# EAGLE board alltogether_8.2_4w (EAGLE 9.1.0), part 1 of 6
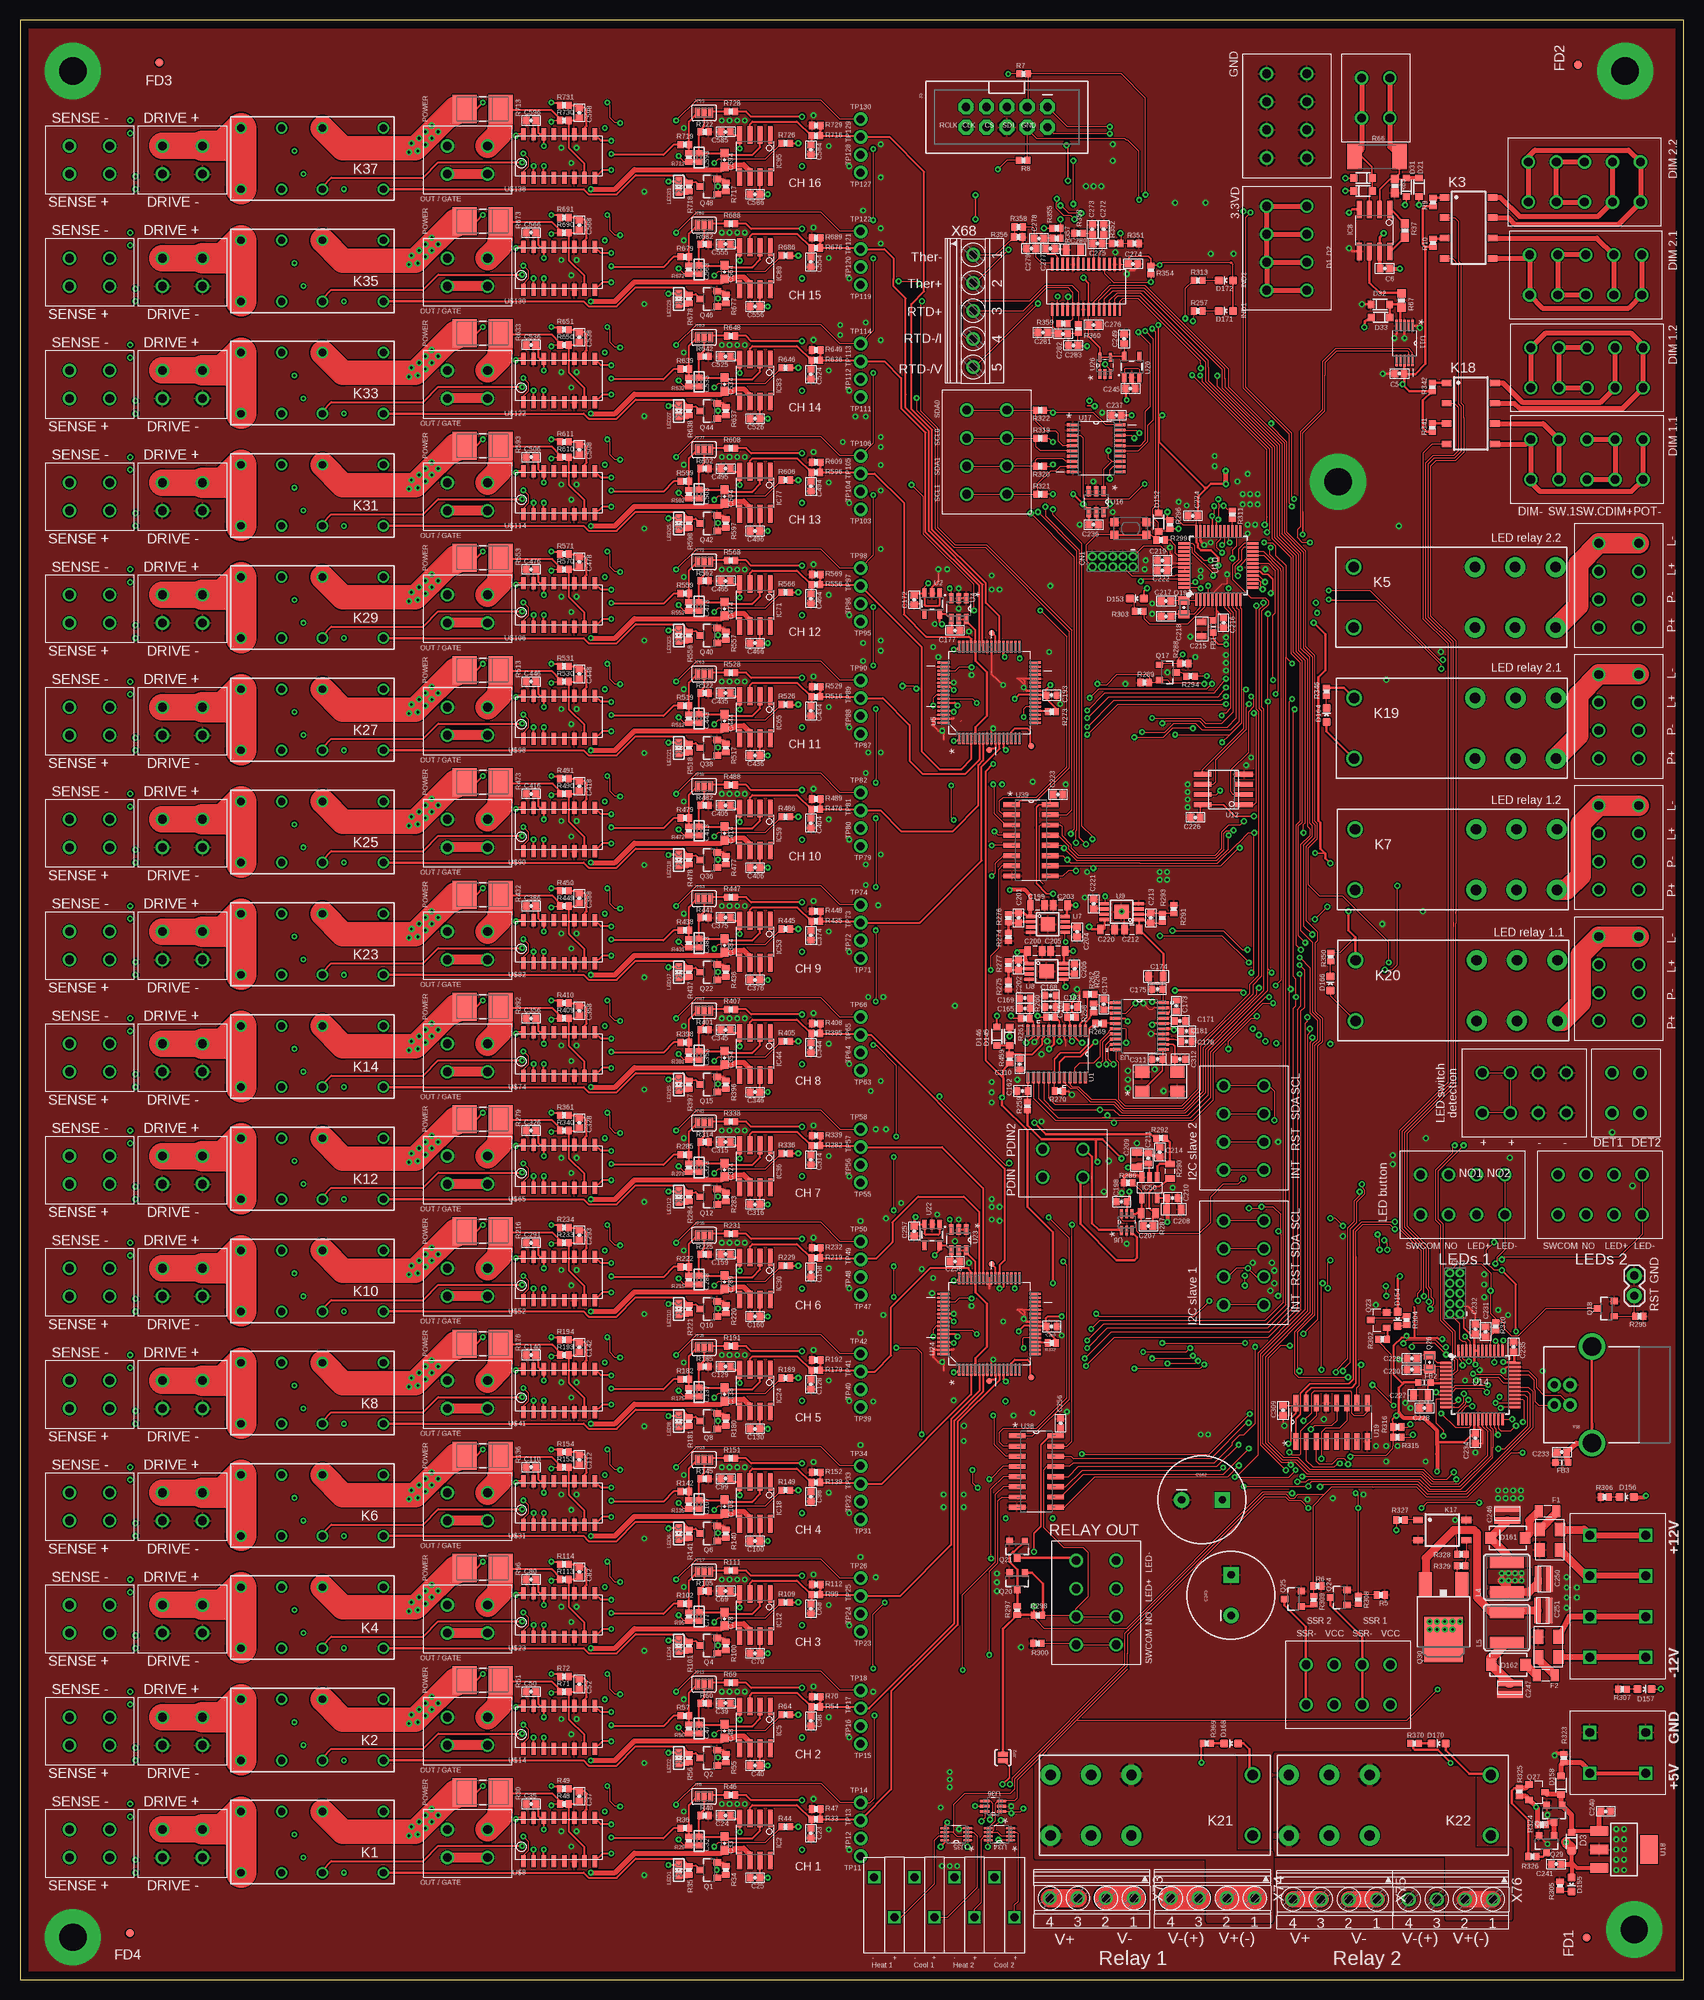
[diagram p31: board, top side]
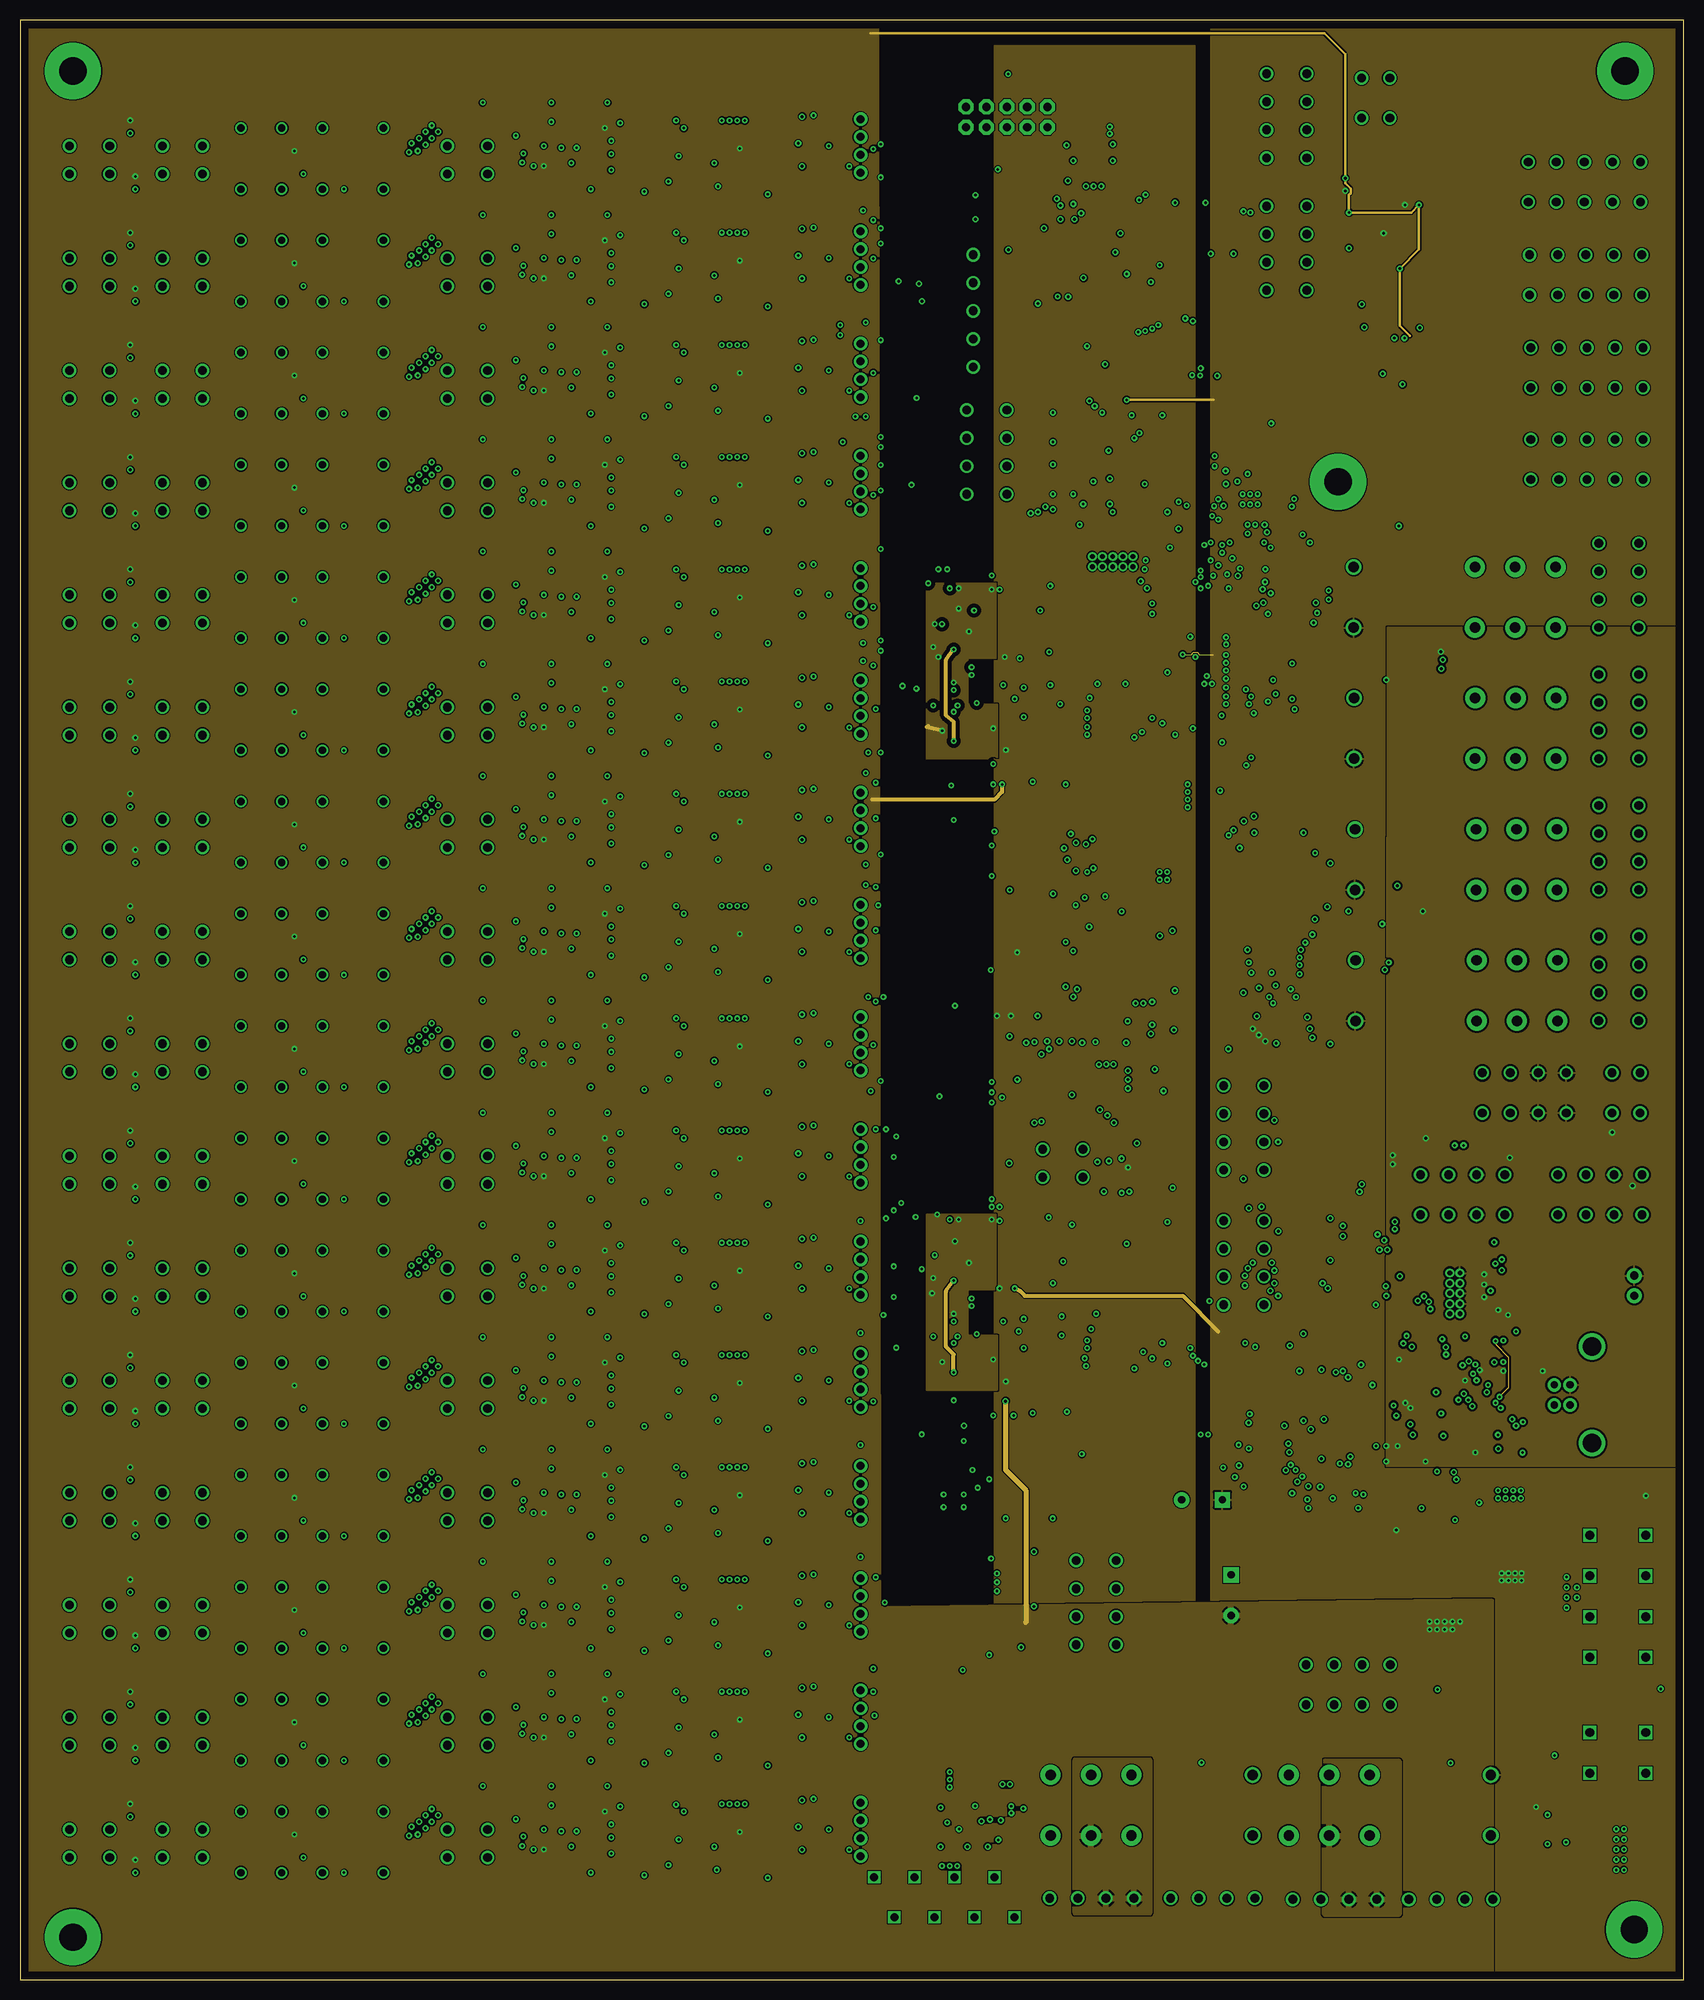
[diagram p32: board, inner layer Route2]
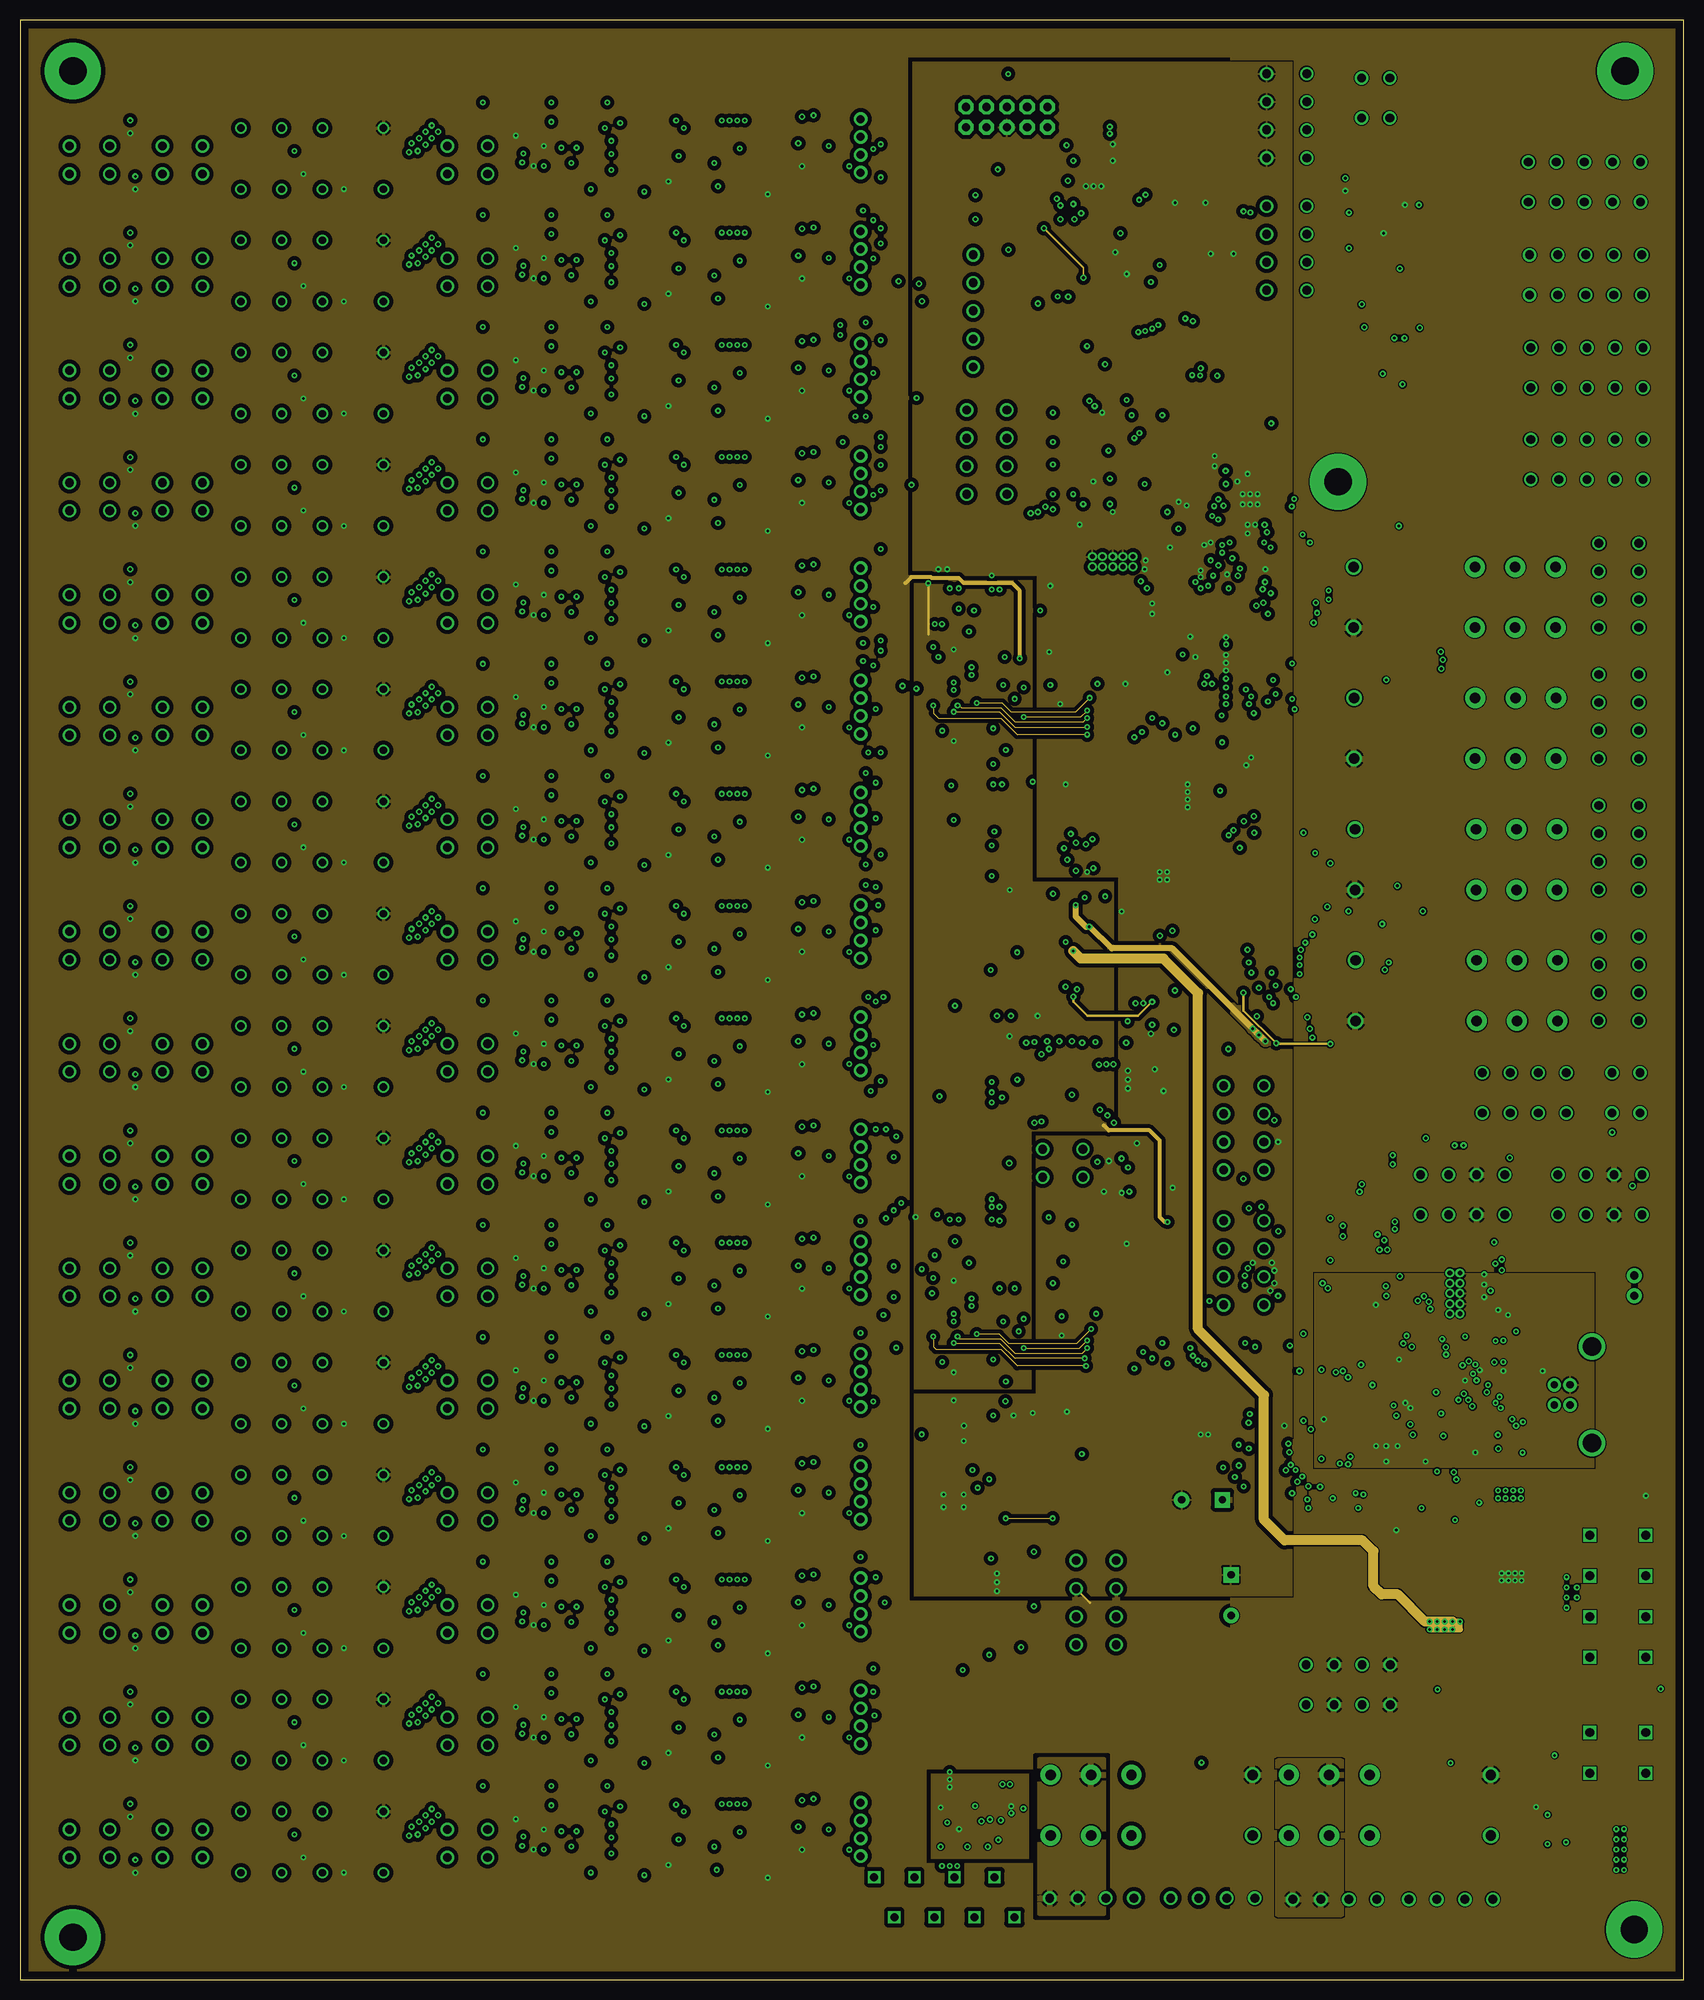
[diagram p33: board, inner layer Route15]
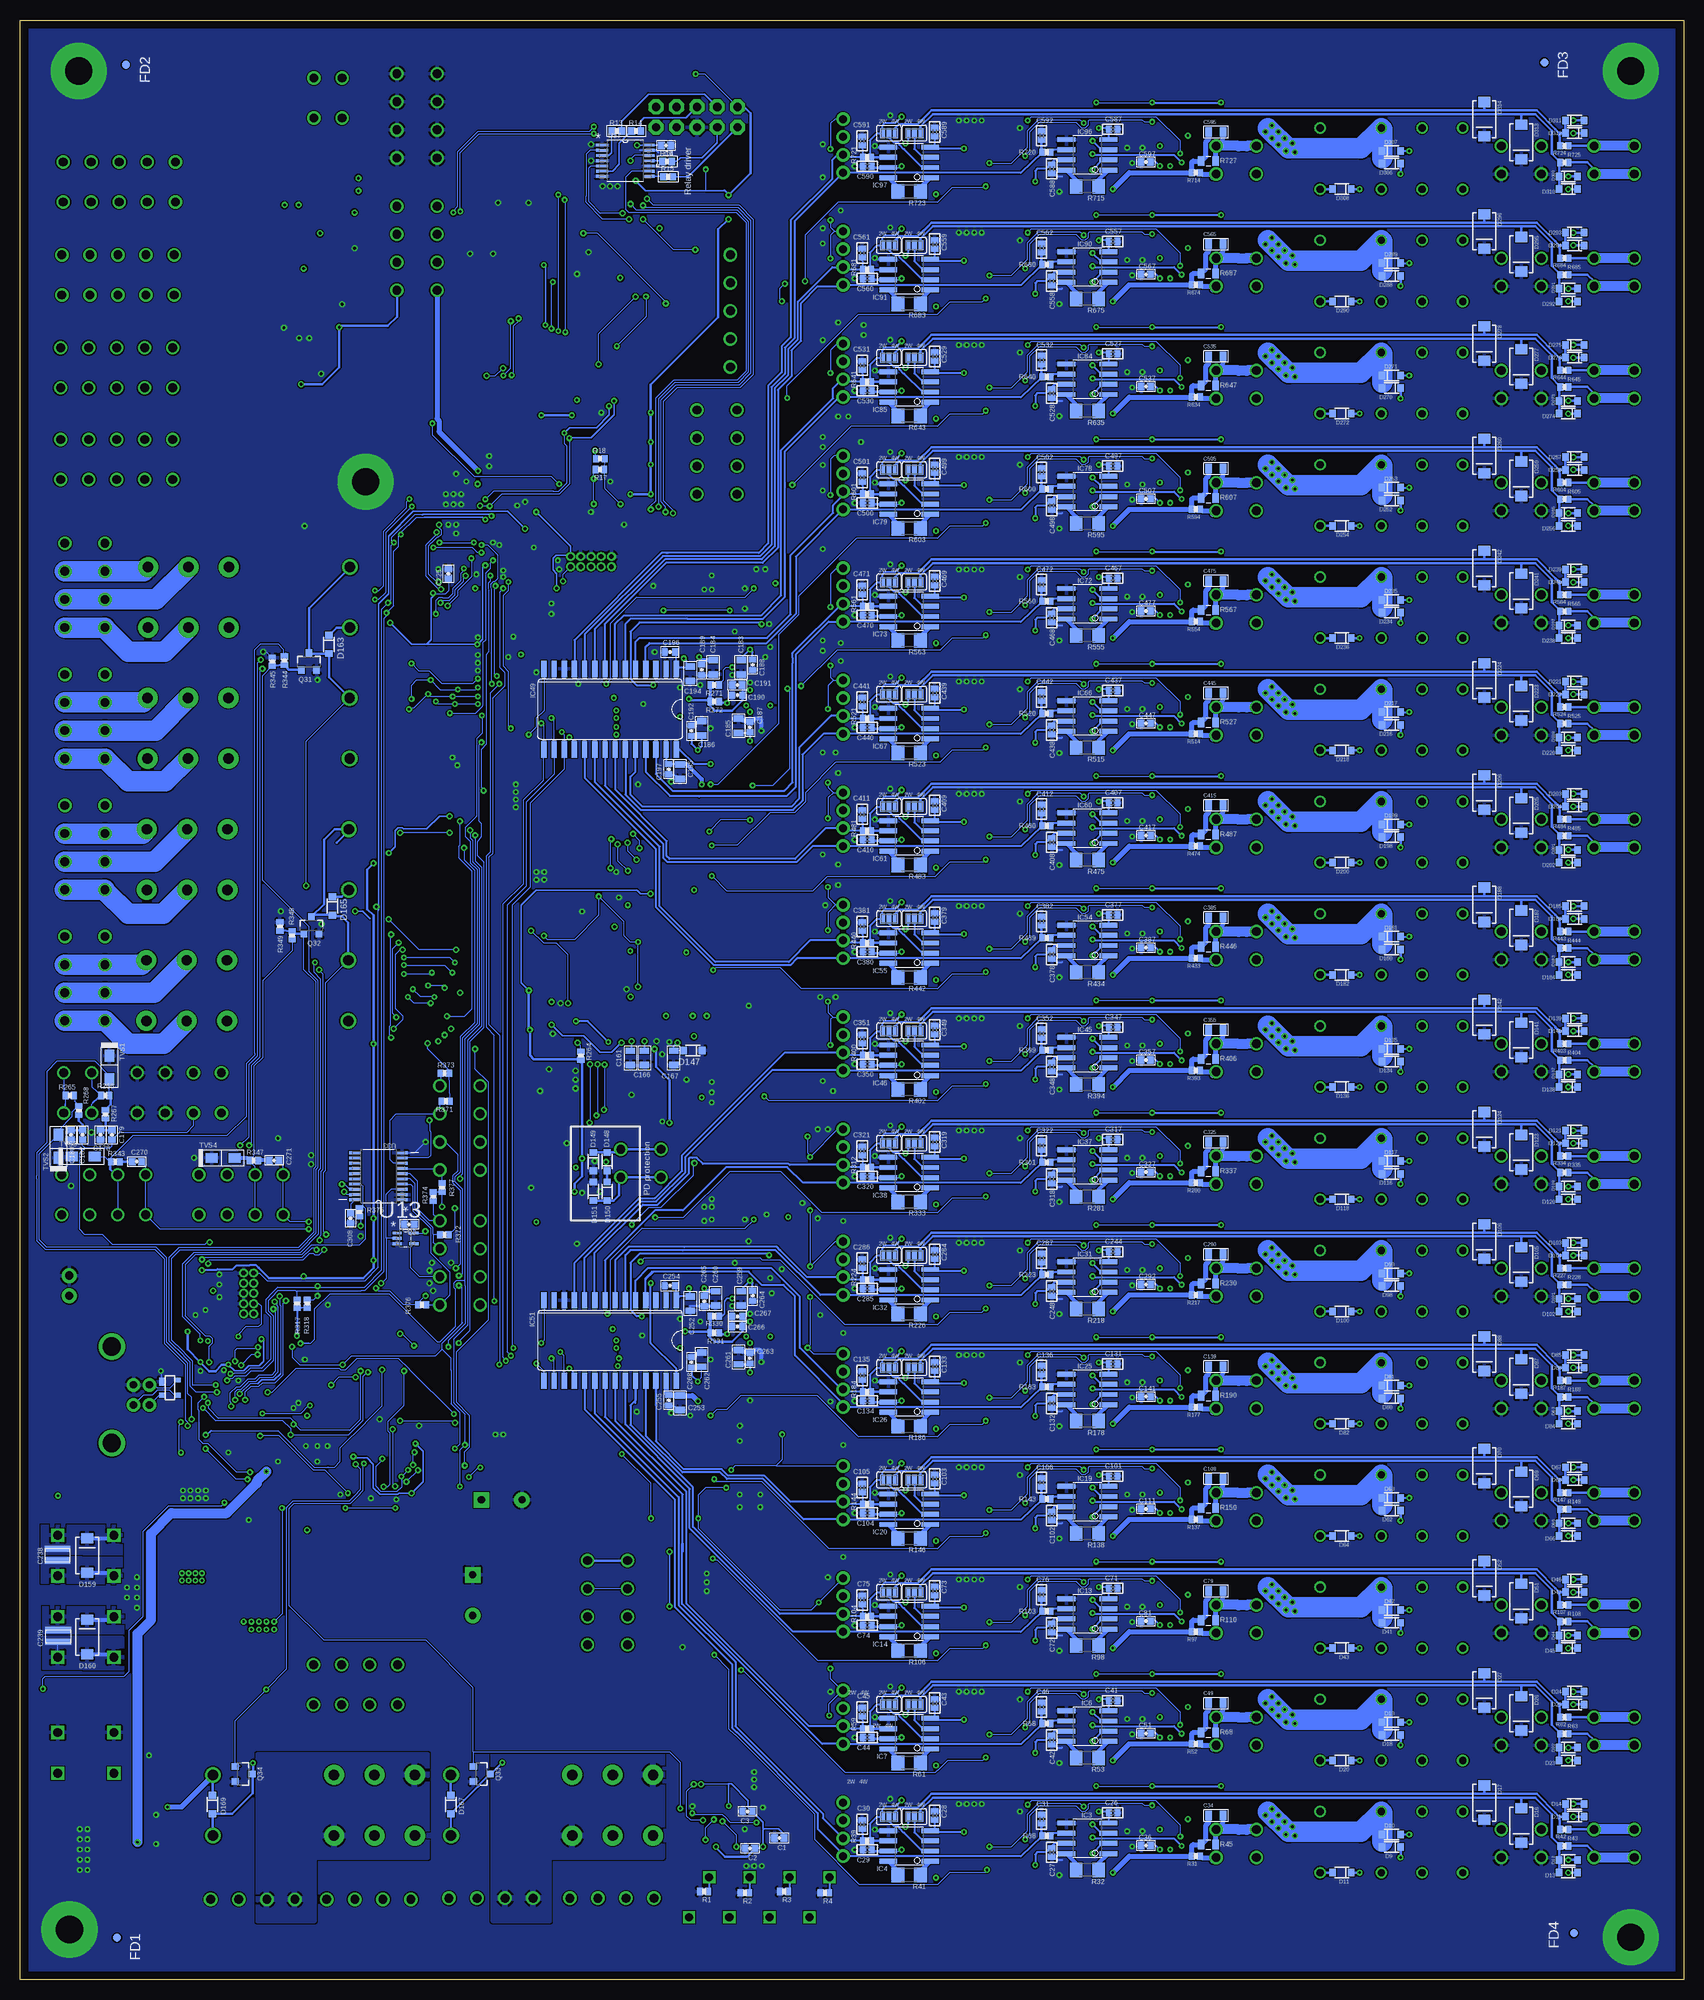
[diagram p34: board, bottom side, seen from below]

Size 207.58 x 244.48 mm. Coordinates in mm from the lower left corner, seen from the top.
Outline: 207.58,0 207.58,244.48 0,244.48 0,0 207.58,0
Copper layers ((1*2)+(15*16)): Top 0.035mm / dielectric 1.5mm / Route2 0.035mm / dielectric 0.15mm / Route15 0.035mm / dielectric 0.2mm / Bottom 0.035mm
Design rules "default *": minimum track width 6mil, minimum drill 0.3mm, track to track 6mil, track to pad 6mil, pad to pad 6mil, via to via 6mil, smd to smd 6mil, copper to edge 40mil, drill to drill 8mil, minimum pad ring 10mil, minimum via ring 8mil, stop-mask expansion 4mil, vias tented up to drill 0mil, thermal gap 10mil
Net classes: 2 gnd: width 0.152 mm, drill 0.305 mm, clearance 0.152 mm

## Footprints (pad centres in the part's own frame; a part is rotated, then mirrored left to right if it is on the bottom)
0402-CAP = smd 0.85 x 0.9: 1 -0.58,0; 2 0.58,0
0402 = smd 0.751 x 0.9: 1 -0.508,0; 2 0.548,0
0603-CAP = smd 1.1 x 1: 1 -0.85,0; 2 0.85,0
0805 = smd 0.8 x 1.2: 1 -0.9,0; 2 0.9,0
0402-CAP' = smd 0.7 x 0.9: 1 -0.65,0; 2 0.65,0
LLL31 = smd 0.8 x 3.2: P$1 0,1.6; P$2 1.44,1.6
CPOL-RADIAL-1000UF-25V = drill 0.9 pad 1.93 square: + 2.54,0 | drill 0.9 pad 1.93: - -2.54,0
CONNETTORI_PINHEAD-2X5-P127 = drill 0.61 pad 1.016: 1 -0.635,2.54; 2 0.635,2.54; 3 -0.635,1.27; 4 0.635,1.27; 5 -0.635,0; 6 0.635,0; 7 -0.635,-1.27; 8 0.635,-1.27; 9 -0.635,-2.54; 10 0.635,-2.54
SOD-323 = smd 0.83 x 0.93: A 1.15,0; C -1.15,0
SMA-DIODE = smd 1.27 x 1.47: A -2.15,0; C 2.15,0
LED-0603 = smd 1 x 1: A 0,-0.877; C 0,0.877
PTC0805 = smd 1 x 1.5: 1 -1.1,0; 2 1.1,0
_0603MP = smd 0.8 x 0.8: 1 -0.762,0; 2 0.762,0
SO08 = smd 0.61 x 2.21: 1 -1.905,-2.616; 2 -0.635,-2.616; 3 0.635,-2.616; 4 1.905,-2.616; 5 1.905,2.616; 6 0.635,2.616; 7 -0.635,2.616; 8 -1.905,2.616
SO28L = smd 0.66 x 2.032: 1 -8.255,-5.029; 2 -6.985,-5.029; 3 -5.715,-5.029; 4 -4.445,-5.029; 5 -3.175,-5.029; 6 -1.905,-5.029; 7 -0.635,-5.029; 8 0.635,-5.029; 9 1.905,-5.029; 10 3.175,-5.029; 11 4.445,-5.029; 12 5.715,-5.029; 13 6.985,-5.029; 14 8.255,-5.029; 15 8.255,5.029; 16 6.985,5.029; 17 5.715,5.029; 18 4.445,5.029; 19 3.175,5.029; 20 1.905,5.029; 21 0.635,5.029; 22 -0.635,5.029; 23 -1.905,5.029; 24 -3.175,5.029; 25 -4.445,5.029; 26 -5.715,5.029; 27 -6.985,5.029; 28 -8.255,5.029
SOT23-5 = smd 0.6 x 1.2: 1 -0.95,-1.306; 2 0,-1.306; 3 0.95,-1.306; 4 0.95,1.306; 5 -0.95,1.306
1X02 = drill 1.016 pad 1.88: 1 0,0; 2 2.54,0
2X5-SHROUDED = drill 1.016 pad 1.88 octagon: 1 -1.27,5.08; 2 1.27,5.08; 3 -1.27,2.54; 4 1.27,2.54; 5 -1.27,0; 6 1.27,0; 7 -1.27,-2.54; 8 1.27,-2.54; 9 -1.27,-5.08; 10 1.27,-5.08
PAD-JUMPER-2-NC_BY_PASTE_YES_SILK = smd 0.635 x 1.27: 1 -0.401,0; 2 0.413,0
PAD-JUMPER-3-NC_BY_PASTE_YES_SILK_FULL_BOX = smd 0.635 x 1.27: 1 -0.813,0; 2 0,0; 3 0.813,0
DS-BT = drill 0.9: 1 -8.89,-3.81; 4 -1.27,-3.81; 6 3.81,-3.81; 8 8.89,-3.81; 9 8.89,3.81; 11 3.81,3.81; 13 -1.27,3.81; 16 -8.89,3.81
SOP08 = smd 0.8 x 1.2: 1 -3.81,-3; 2 -1.27,-3; 3 1.27,-3; 4 3.81,-3; 5 3.81,3; 6 1.27,3; 7 -1.27,3; 8 -3.81,3
RT2C/O = drill 1.3 pad 2.5: 11 7.56,-3.68; 12 2.52,-3.68; 14 12.6,-3.68; 21 7.56,3.88; 22 2.52,3.88; 24 12.6,3.88 | drill 1.3: A1 -12.6,-3.68; A2 -12.6,3.88
SOP04 = smd 0.8 x 1.2: 1 -1.27,-3; 2 1.27,-3; 3 1.27,3; 4 -1.27,3
2014 = smd 1.7 x 1.3: P$1 -1.27,1.27; P$2 -1.27,-1.27; P$3 1.27,-1.27; P$4 1.27,1.27
CR54 = smd 4.2 x 1.4: P$1 0,1.85; P$2 0,-1.85
CHIPLED_0603 = smd 0.8 x 0.8: A 0,-0.75; C 0,0.75
SOT23-3 = smd 0.8 x 0.9: 1 -0.95,-1; 2 0.95,-1; 3 0,1.1
FC-12M = smd 1.03 x 1.4: 1 -0.85,0; 2 0.85,0
SOT23-3' = smd 0.8 x 0.9: 1 -0.95,-1; 2 0.95,-1; 3 0,1
DPAK = smd 1.6 x 3: 1 -2.28,-5.31; 3 2.28,-5.31 | smd 4.826 x 5.715: 4 0,1.588
0402-RES = smd 0.751 x 0.9: 1 -0.483,0; 2 0.548,0
0402-RES' = smd 0.85 x 0.9: 1 -0.58,0; 2 0.58,0
2512 = smd 3 x 3.5: 1 -2.25,0; 2 2.25,0
1206 = smd 1.6 x 1.8: 1 -1.4,0; 2 1.4,0
0603-RES = smd 1.1 x 1: 1 -0.85,0; 2 0.85,0
R2512 = smd 1.8 x 3.2: 1 -2.8,0; 2 2.8,0
KMR2 = smd 1 x 1: 1 2,0.8; 2 2,-0.8; 3 -2,0.8; 4 -2,-0.8
PAD.03X.03 = smd 0.762 x 0.762: P$1 0,0
1X01_ROUND = drill 1 pad 1.676: 1 0,0
SOD-323' = smd 1.5 x 1.2: ANODE 1.45,0; CATH -1.45,0
SOP65P640X120-24N = smd 1.473 x 0.356: 1 -2.921,3.581; 2 -2.921,2.921; 3 -2.921,2.286; 4 -2.921,1.626; 5 -2.921,0.965; 6 -2.921,0.33; 7 -2.921,-0.33; 8 -2.921,-0.965; 9 -2.921,-1.626; 10 -2.921,-2.286; 11 -2.921,-2.921; 12 -2.921,-3.581; 13 2.921,-3.581; 14 2.921,-2.921; 15 2.921,-2.286; 16 2.921,-1.626; 17 2.921,-0.965; 18 2.921,-0.33; 19 2.921,0.33; 20 2.921,0.965; 21 2.921,1.626; 22 2.921,2.286; 23 2.921,2.921; 24 2.921,3.581
SOT23-5' = smd 0.55 x 1.2: 1 -0.95,-1.3; 2 0,-1.3; 3 0.95,-1.3; 4 0.95,1.3; 5 -0.95,1.3
SOP65P640X120-20N = smd 1.473 x 0.356: 1 -2.921,2.921; 2 -2.921,2.286; 3 -2.921,1.626; 4 -2.921,0.965; 5 -2.921,0.33; 6 -2.921,-0.33; 7 -2.921,-0.965; 8 -2.921,-1.626; 9 -2.921,-2.286; 10 -2.921,-2.921; 11 2.921,-2.921; 12 2.921,-2.286; 13 2.921,-1.626; 14 2.921,-0.965; 15 2.921,-0.33; 16 2.921,0.33; 17 2.921,0.965; 18 2.921,1.626; 19 2.921,2.286; 20 2.921,2.921
SOT95P280X145-6N = smd 1.27 x 0.559: 1 -1.295,0.94; 2 -1.295,0; 3 -1.295,-0.94; 4 1.295,-0.94; 5 1.295,0; 6 1.295,0.94
QFP50P1200X1200X160-64N = smd 1.473 x 0.279: 1 -5.715,3.759; 2 -5.715,3.251; 3 -5.715,2.743; 4 -5.715,2.261; 5 -5.715,1.753; 6 -5.715,1.245; 7 -5.715,0.762; 8 -5.715,0.254; 9 -5.715,-0.254; 10 -5.715,-0.762; 11 -5.715,-1.245; 12 -5.715,-1.753; 13 -5.715,-2.261; 14 -5.715,-2.743; 15 -5.715,-3.251; 16 -5.715,-3.759; 33 5.715,-3.759; 34 5.715,-3.251; 35 5.715,-2.743; 36 5.715,-2.261; 37 5.715,-1.753; 38 5.715,-1.245; 39 5.715,-0.762; 40 5.715,-0.254; 41 5.715,0.254; 42 5.715,0.762; 43 5.715,1.245; 44 5.715,1.753; 45 5.715,2.261; 46 5.715,2.743; 47 5.715,3.251; 48 5.715,3.759 | smd 0.279 x 1.473: 17 -3.759,-5.715; 18 -3.251,-5.715; 19 -2.743,-5.715; 20 -2.261,-5.715; 21 -1.753,-5.715; 22 -1.245,-5.715; 23 -0.762,-5.715; 24 -0.254,-5.715; 25 0.254,-5.715; 26 0.762,-5.715; 27 1.245,-5.715; 28 1.753,-5.715; 29 2.261,-5.715; 30 2.743,-5.715; 31 3.251,-5.715; 32 3.759,-5.715; 49 3.759,5.715; 50 3.251,5.715; 51 2.743,5.715; 52 2.261,5.715; 53 1.753,5.715; 54 1.245,5.715; 55 0.762,5.715; 56 0.254,5.715; 57 -0.254,5.715; 58 -0.762,5.715; 59 -1.245,5.715; 60 -1.753,5.715; 61 -2.261,5.715; 62 -2.743,5.715; 63 -3.251,5.715; 64 -3.759,5.715
SOT65P210X110-6N = smd 1.168 x 0.356: 1 -1.041,0.66; 2 -1.041,0; 3 -1.041,-0.66; 4 1.041,-0.66; 5 1.041,0; 6 1.041,0.66
S-PDSO-G08 = smd 0.4 x 1.2: 1 -0.975,-2.157; 2 -0.325,-2.157; 3 0.325,-2.157; 4 0.975,-2.157; 5 0.975,2.157; 6 0.325,2.157; 7 -0.325,2.157; 8 -0.975,2.157 | smd 1.73 x 1.78: TH 0,0
TQFP-48 = smd 1.5 x 0.28: 1 -4.25,2.75; 2 -4.25,2.25; 3 -4.25,1.75; 4 -4.25,1.25; 5 -4.25,0.75; 6 -4.25,0.25; 7 -4.25,-0.25; 8 -4.25,-0.75; 9 -4.25,-1.25; 10 -4.25,-1.75; 11 -4.25,-2.25; 12 -4.25,-2.75; 25 4.25,-2.75; 26 4.25,-2.25; 27 4.25,-1.75; 28 4.25,-1.25; 29 4.25,-0.75; 30 4.25,-0.25; 31 4.25,0.25; 32 4.25,0.75; 33 4.25,1.25; 34 4.25,1.75; 35 4.25,2.25; 36 4.25,2.75 | smd 0.28 x 1.5: 13 -2.75,-4.25; 14 -2.25,-4.25; 15 -1.75,-4.25; 16 -1.25,-4.25; 17 -0.75,-4.25; 18 -0.25,-4.25; 19 0.25,-4.25; 20 0.75,-4.25; 21 1.25,-4.25; 22 1.75,-4.25; 23 2.25,-4.25; 24 2.75,-4.25; 37 2.75,4.25; 38 2.25,4.25; 39 1.75,4.25; 40 1.25,4.25; 41 0.75,4.25; 42 0.25,4.25; 43 -0.25,4.25; 44 -0.75,4.25; 45 -1.25,4.25; 46 -1.75,4.25; 47 -2.25,4.25; 48 -2.75,4.25
SOP50P490X110-10N = smd 1.422 x 0.279: 1 -2.184,0.991; 2 -2.184,0.508; 3 -2.184,0; 4 -2.184,-0.508; 5 -2.184,-0.991; 6 2.184,-0.991; 7 2.184,-0.508; 8 2.184,0; 9 2.184,0.508; 10 2.184,0.991
SOIC-8 = smd 0.6 x 2.2: 1 -1.905,-2.6; 2 -0.635,-2.6; 3 0.635,-2.6; 4 1.905,-2.6; 5 1.905,2.6; 6 0.635,2.6; 7 -0.635,2.6; 8 -1.905,2.6
SOT65P210X110-5N = smd 1.168 x 0.356: 1 -1.041,0.66; 2 -1.041,0; 3 -1.041,-0.66; 4 1.041,-0.66; 5 1.041,0.66
SOP65P640X110-20N = smd 1.473 x 0.356: 1 -2.921,2.921; 2 -2.921,2.286; 3 -2.921,1.626; 4 -2.921,0.965; 5 -2.921,0.33; 6 -2.921,-0.33; 7 -2.921,-0.965; 8 -2.921,-1.626; 9 -2.921,-2.286; 10 -2.921,-2.921; 11 2.921,-2.921; 12 2.921,-2.286; 13 2.921,-1.626; 14 2.921,-0.965; 15 2.921,-0.33; 16 2.921,0.33; 17 2.921,0.965; 18 2.921,1.626; 19 2.921,2.286; 20 2.921,2.921
SOT223 = smd 1.219 x 2.235: 1 -2.311,-3.099; 2 0,-3.099; 3 2.311,-3.099 | smd 3.6 x 2.2: 4 0,3.099
SOIC127P600X175-16N = smd 2.057 x 0.61: 1 -4.801,8.89; 2 -4.801,7.62; 3 -4.801,6.35; 4 -4.801,5.08; 5 -4.801,3.81; 6 -4.801,2.54; 7 -4.801,1.27; 8 -4.801,0; 9 0,0; 10 0,1.27; 11 0,2.54; 12 0,3.81; 13 0,5.08; 14 0,6.35; 15 0,7.62; 16 0,8.89
R-PDSO-G28 = smd 0.3 x 1.6: P$1 -4.55,-2.8; P$2 -3.9,-2.8; P$3 -3.25,-2.8; P$4 -2.6,-2.8; P$5 -1.95,-2.8; P$6 -1.3,-2.8; P$7 -0.65,-2.8; P$8 0,-2.8; P$9 0.65,-2.8; P$10 1.3,-2.8; P$11 1.95,-2.8; P$12 2.6,-2.8; P$13 3.25,-2.8; P$14 3.9,-2.8; P$15 3.9,2.8; P$16 3.25,2.8; P$17 2.6,2.8; P$18 1.95,2.8; P$19 1.3,2.8; P$20 0.65,2.8; P$21 0,2.8; P$22 -0.65,2.8; P$23 -1.3,2.8; P$24 -1.95,2.8; P$25 -2.6,2.8; P$26 -3.25,2.8; P$27 -3.9,2.8; P$28 -4.55,2.8
SOP50P310X90-8N = smd 1.067 x 0.254: 1 -1.422,0.762; 2 -1.422,0.254; 3 -1.422,-0.254; 4 -1.422,-0.762; 5 1.422,-0.762; 6 1.422,-0.254; 7 1.422,0.254; 8 1.422,0.762
SOP65P640X120-14N = smd 1.473 x 0.356: 1 -2.921,1.956; 2 -2.921,1.295; 3 -2.921,0.66; 4 -2.921,0; 5 -2.921,-0.66; 6 -2.921,-1.295; 7 -2.921,-1.956; 8 2.921,-1.956; 9 2.921,-1.295; 10 2.921,-0.66; 11 2.921,0; 12 2.921,0.66; 13 2.921,1.295; 14 2.921,1.956
ABMM2 = smd 1.8 x 1.4: P$1 -2.2,-2.4; P$2 2.2,-2.4; P$3 2.2,0; P$4 -2.2,0
SPTAF1/2-3.5 = drill 1.1: P$1 -1.92,2.5; P$2 -1.92,-2.5; P$3 1.58,2.5; P$4 1.58,-2.5
R-PDSO-G16 = smd 0.55 x 1.5: P$1 -5.08,-2.7; P$2 -3.81,-2.7; P$3 -2.54,-2.7; P$4 -1.27,-2.7; P$5 0,-2.7; P$6 1.27,-2.7; P$7 2.54,-2.7; P$8 3.81,-2.7; P$9 3.81,2.7; P$10 2.54,2.7; P$11 1.27,2.7; P$12 0,2.7; P$13 -1.27,2.7; P$14 -2.54,2.7; P$15 -3.81,2.7; P$16 -5.08,2.7
PTSA0,5/8-2,5-Z = drill 1 square: P$1 7.5,-2.5; P$2 5,2.5; P$3 2.5,-2.5; P$4 0,2.5; P$5 -2.5,-2.5; P$6 -5,2.5; P$7 -7.5,-2.5; P$8 -10,2.5
PRTR5V0U2X = smd 1 x 0.7: P$1 -0.75,-1 | smd 0.6 x 0.7: P$2 0.95,-1; P$3 0.95,1; P$4 -0.95,1
FIDUCIAL = smd 1 x 1: P$1 0,0
SPTAF1/4-3.5 = drill 1.1: P$1 -7,2.5; P$2 -7,-2.5; P$3 -3.5,2.5; P$4 -3.5,-2.5; P$5 0,2.5; P$6 0,-2.5; P$7 3.5,2.5; P$8 3.5,-2.5
SPTAF1/5-3.5 = drill 1.1: P$1 -7,2.5; P$2 -7,-2.5; P$3 -3.5,2.5; P$4 -3.5,-2.5; P$5 0,2.5; P$6 0,-2.5; P$7 3.5,2.5; P$8 3.5,-2.5; P$9 7,2.5; P$10 7,-2.5
USB-B-PTH = drill 0.914 pad 1.676: D+ 0,1.25; D- 1.981,1.25; GND 0,-1.25; VBUS 1.981,-1.25 | drill 2.286: S1 -2.718,-6.02; S2 -2.718,6.02
SPTA1.5/2 = drill 1.1 square: P$1 -2.54,3.5; P$2 -2.54,-3.5; P$3 2.54,-3.5; P$4 2.54,3.5
SPTA1.5/4 = drill 1.1 square: P$1 -2.54,3.5; P$2 -2.54,-3.5; P$3 2.54,-3.5; P$4 2.54,3.5; P$5 7.62,3.5; P$6 7.62,-3.5; P$7 12.7,3.5; P$8 12.7,-3.5
1751277 = drill 1.1 pad 1.7: 1 -7,-0.1; 2 -3.5,-0.1; 3 0,-0.1; 4 3.5,-0.1; 5 7,-0.1
1751264 = drill 1.1 pad 1.7: 1 -5.25,-0.1; 2 -1.75,-0.1; 3 1.75,-0.1; 4 5.25,-0.1

## Placement (x,y rotation side)
C1  0.1u  [0402-CAP]  112.85,17.7 180 bottom
C2  0.1u  [0402-CAP]  116.5,16.43 180 bottom
C3  0.1u  [0402-CAP]  116.82,21.03 180 bottom
C4  0.1u  [0402-CAP]  126.98,228.84 180 bottom
C5  [0402-CAP]  172.12,200.37 180 top
C6  [0402-CAP]  170.28,213.48 180 top
C7  0.1u  [0402-CAP]  159.01,94.26 180 bottom
C23  120n  [0402-CAP]  98.69,18.31 270 top
C24  0.1u  [0402-CAP]  88.05,20.53 180 top
C25  0.1u  [0402-CAP]  91.71,12.75 180 top
C26  0.1u  [0402]  71.23,20.85 0 bottom
C27  0.1u  [0402]  78.85,15.92 270 bottom
C28  0.1u  [0402]  93.45,20.53 270 bottom
C29  0.1u  [0402]  101.87,16.24 0 bottom
C30  1n  [0402]  102.5,19.42 270 bottom
C31  1n  [0402]  80.12,20.05 90 bottom
C32  0.1u  [0402]  84.72,17.35 270 top
C33  0.1u  [0603-CAP]  87.9,17.04 270 top
C34  22u  [0805]  58.37,20.53 0 bottom
C35  0.1u  [0402-CAP]  63.76,21.96 0 top
C36  0.1u  [0402-CAP]  67.11,16.76 0 bottom
C37  1n  [0402-CAP]  69.8,22.91 90 top
C38  120n  [0402-CAP]  98.69,32.31 270 top
C39  0.1u  [0402-CAP]  88.05,34.53 180 top
C40  0.1u  [0402-CAP]  91.71,26.75 180 top
C41  0.1u  [0402]  71.23,34.85 0 bottom
C42  0.1u  [0402]  78.85,29.92 270 bottom
C43  0.1u  [0402]  93.45,34.53 270 bottom
C44  0.1u  [0402]  101.87,30.24 0 bottom
C45  1n  [0402]  102.5,33.42 270 bottom
C46  1n  [0402]  80.12,34.05 90 bottom
C47  0.1u  [0402]  84.72,31.35 270 top
C48  0.1u  [0603-CAP]  87.9,31.04 270 top
C49  22u  [0805]  58.37,34.53 0 bottom
C50  0.1u  [0402-CAP]  63.76,35.96 0 top
C51  0.1u  [0402-CAP]  67.11,30.76 0 bottom
C52  1n  [0402-CAP]  69.8,36.91 90 top
C68  120n  [0402-CAP]  98.69,46.31 270 top
C69  0.1u  [0402-CAP]  88.05,48.53 180 top
C70  0.1u  [0402-CAP]  91.71,40.75 180 top
C71  0.1u  [0402]  71.23,48.85 0 bottom
C72  0.1u  [0402]  78.85,43.92 270 bottom
C73  0.1u  [0402]  93.45,48.53 270 bottom
C74  0.1u  [0402]  101.87,44.24 0 bottom
C75  1n  [0402]  102.5,47.42 270 bottom
C76  1n  [0402]  80.12,48.05 90 bottom
C77  0.1u  [0402]  84.72,45.35 270 top
C78  0.1u  [0603-CAP]  87.9,45.04 270 top
C79  22u  [0805]  58.37,48.53 0 bottom
C80  0.1u  [0402-CAP]  63.76,49.96 0 top
C81  0.1u  [0402-CAP]  67.11,44.76 0 bottom
C82  1n  [0402-CAP]  69.8,50.91 90 top
C98  120n  [0402-CAP]  98.69,60.31 270 top
C99  0.1u  [0402-CAP]  88.05,62.53 180 top
C100  0.1u  [0402-CAP]  91.71,54.75 180 top
C101  0.1u  [0402]  71.23,62.85 0 bottom
C102  0.1u  [0402]  78.85,57.92 270 bottom
C103  0.1u  [0402]  93.45,62.53 270 bottom
C104  0.1u  [0402]  101.87,58.24 0 bottom
C105  1n  [0402]  102.5,61.42 270 bottom
C106  1n  [0402]  80.12,62.05 90 bottom
C107  0.1u  [0402]  84.72,59.35 270 top
C108  0.1u  [0603-CAP]  87.9,59.04 270 top
C109  22u  [0805]  58.37,62.53 0 bottom
C110  0.1u  [0402-CAP]  63.76,63.96 0 top
C111  0.1u  [0402-CAP]  67.11,58.76 0 bottom
C112  1n  [0402-CAP]  69.8,64.91 90 top
C128  120n  [0402-CAP]  98.69,74.31 270 top
C129  0.1u  [0402-CAP]  88.05,76.53 180 top
C130  0.1u  [0402-CAP]  91.71,68.75 180 top
C131  0.1u  [0402]  71.23,76.85 0 bottom
C132  0.1u  [0402]  78.85,71.92 270 bottom
C133  0.1u  [0402]  93.45,76.53 270 bottom
C134  0.1u  [0402]  101.87,72.24 0 bottom
C135  1n  [0402]  102.5,75.42 270 bottom
C136  1n  [0402]  80.12,76.05 90 bottom
C137  0.1u  [0402]  84.72,73.35 270 top
C138  0.1u  [0603-CAP]  87.9,73.04 270 top
C139  22u  [0805]  58.37,76.53 0 bottom
C140  0.1u  [0402-CAP]  63.76,77.96 0 top
C141  0.1u  [0402-CAP]  67.11,72.76 0 bottom
C142  1n  [0402-CAP]  69.8,78.91 90 top
C158  120n  [0402-CAP]  98.69,88.31 270 top
C159  0.1u  [0402-CAP]  88.05,90.53 180 top
C160  0.1u  [0402-CAP]  91.71,82.75 180 top
C161  10u  [0805]  131.42,115.01 270 bottom
C162  470n  [0402-CAP']  125.07,110.89 180 top
C163  470n  [0402-CAP']  131.26,121.36 0 top
C164  470n  [0402-CAP']  128.56,121.36 180 top
C165  470n  [0402-CAP']  125.39,121.2 180 top
C166  10u  [0805]  129.67,115.01 270 bottom
C167  10u  [0805]  126.02,115.01 270 bottom
C168  0.1u  [0402-CAP']  128.56,122.79 180 top
C169  0.1u  [0402-CAP']  125.39,122.47 180 top
C170  10n  [0402-CAP']  135.23,121.68 270 top
C171  0.1u  [0402-CAP']  145.55,118.35 0 top
C172  0.1u  [0402-CAP]  111.58,172.16 270 top
C173  1u  [0402-CAP']  144.28,121.52 90 top
C174  10u  [0805]  141.74,125.17 180 top
C175  0.1u  [0402-CAP']  141.9,123.59 180 top
C176  1u  [0402-CAP']  145.55,117.08 180 top
C177  2.2u  [0402-CAP]  116.66,168.35 0 top
C178  0.1u  [0402-CAP]  197.55,105.41 90 bottom
C179  0.1u  [0402-CAP]  196.12,105.41 90 bottom
C180  0.1u  [0402-CAP]  201.2,105.41 90 bottom
C181  1u  [0402-CAP']  144.75,119.62 180 top
C182  0.1u  [0402-CAP]  199.77,105.41 90 bottom
C183  10u  [0805]  117.61,163.75 270 bottom
C184  10u  [0805]  121.1,163.75 90 bottom
C185  10u  [0805]  117.93,156.45 90 bottom
C186  10u  [0805]  122.53,156.13 270 bottom
C187  0.1u  [0402-CAP']  116.5,156.29 90 bottom
C188  0.1u  [0402-CAP']  116.18,164.07 270 bottom
C189  0.1u  [0402-CAP']  122.53,163.43 90 bottom
C190  1u  [0402-CAP']  118.09,160.26 0 bottom
C191  0.1u  [0402-CAP]  118.09,161.53 180 bottom
C192  0.1u  [0402-CAP']  123.8,155.81 270 bottom
C193  0.1u  [0402-CAP']  128.72,160.26 180 top
C194  10u  [0805]  123.96,162.96 90 bottom
C195  10u  [0805]  125.23,150.73 270 bottom
C196  0.1u  [0402-CAP']  126.5,165.65 0 bottom
C197  0.1u  [0402-CAP']  126.66,151.05 270 bottom
C198  0.1u  [0402-CAP']  137.45,97.07 0 top
C199  10u  [0805]  126.98,134.06 180 top
C200  10u  [0805]  126.66,128.35 180 top
C201  10n  [0402-CAP]  124.59,132.48 270 top
C202  10n  [0402-CAP]  124.59,126.6 270 top
C203  10u  [0805]  129.83,134.06 180 top
C204  10n  [0402-CAP]  131.9,130.73 270 top
C205  10u  [0805]  129.52,128.35 180 top
C206  10n  [0402-CAP]  131.58,126.13 90 top
C207  0.1u  [0402-CAP]  140.79,94.06 0 top
C208  10u  [0805]  143.96,96.12 180 top
C209  10u  [0805]  139.36,102.31 90 top
C210  0.1u  [0402-CAP']  143.8,97.55 180 top
C211  1n  [0402-CAP']  140.79,102.47 90 top
C212  10u  [0805]  138.72,131.05 0 top
C213  10n  [0402-CAP]  141.1,132.48 90 top
C214  10n  [0402-CAP]  142.22,103.27 270 top
C215  10u  [0805]  147.45,168.51 90 top
C216  0.1u  [0402-CAP]  150.15,169.31 90 top
C217  22p  [0402-CAP]  143.01,172 0 top
C218  22p  [0402-CAP]  143.01,170.1 0 top
C219  0.1u  [0402-CAP]  142.53,177.08 180 top
C220  10u  [0805]  135.71,131.05 0 top
C221  10n  [0402-CAP]  133.96,134.22 90 top
C222  1u  [0402-CAP]  142.53,175.81 180 top
C223  0.1u  [0402-CAP]  129.52,147.87 0 top
C224  0.1u  [0402-CAP]  146.34,182.64 180 top
C225  0.1u  [0402-CAP]  154.13,175.42 90 bottom
C226  0.1u  [0402-CAP]  146.66,145.02 0 top
C227  10u  [0805]  174.76,72.94 0 top
C228  0.1u  [0402-CAP]  175.24,71.36 0 top
C229  22p  [0402-CAP]  173.65,77.55 0 top
C230  22p  [0402-CAP]  173.65,76.12 0 top
C231  0.1u  [0402-CAP]  182.86,80.88 90 top
C232  1u  [0402-CAP]  181.59,81.2 90 top
C233  0.1u  [0402-CAP]  192.39,65.84 0 top
C234  0.1u  [0402-CAP]  181.59,67.55 270 top
C235  0.1u  [0402-CAP]  186.35,78.98 90 top
C236  0.1u  [0402-CAP]  133.96,181.53 0 top
C237  0.1u  [0402-CAP]  136.82,195.18 0 top
C238  CAPACITOR  [LLL31]  204.51,53.79 270 bottom
C239  CAPACITOR  [LLL31]  204.43,43.63 270 bottom
C240  0.1u  [0402-CAP]  197.86,21.04 0 top
C241  4.7u  [0402-CAP]  191.67,14.45 180 top
C242  [CPOL-RADIAL-1000UF-25V]  147.49,59.9 0 top
C243  [CPOL-RADIAL-1000UF-25V]  151.11,48 90 top
C244  0.1u  [0402]  71.23,90.85 0 bottom
C245  0.1u  [0402-CAP]  138.56,198.52 0 top
C246  1u  [LLL31]  187.17,57.34 90 top
C247  1u  [LLL31]  187.5,35.63 90 top
C248  0.1u  [0402]  78.85,85.92 270 bottom
C249  2.2u  [0402-CAP]  137.77,204.71 90 top
C250  1u  [LLL31]  189.4,48.42 0 top
C251  1u  [LLL31]  190.81,47.68 180 top
C252  10u  [0805]  123.96,84.37 90 bottom
C253  10u  [0805]  125.23,71.99 270 bottom
C254  0.1u  [0402-CAP']  126.5,86.6 0 bottom
C255  0.1u  [0402-CAP']  126.66,72.31 270 bottom
C256  0.1u  [0402-CAP]  129.83,69.45 90 top
C257  0.1u  [0402-CAP]  111.58,93.42 270 top
C258  2.2u  [0402-CAP]  116.66,89.61 0 top
C259  10u  [0805]  117.61,85.01 270 bottom
C260  10u  [0805]  120.78,85.01 90 bottom
C261  10u  [0805]  117.93,77.71 90 bottom
C262  10u  [0805]  122.53,77.39 270 bottom
C263  0.1u  [0402-CAP']  116.5,77.55 90 bottom
C264  0.1u  [0402-CAP']  116.18,85.33 270 bottom
C265  0.1u  [0402-CAP']  122.21,84.69 90 bottom
C266  1u  [0402-CAP']  118.09,81.52 0 bottom
C267  0.1u  [0402-CAP']  118.09,82.79 180 bottom
C268  0.1u  [0402-CAP']  123.8,77.07 270 bottom
C269  0.1u  [0402-CAP']  128.72,81.52 180 top
C270  1n  [0402-CAP]  193.02,102.07 180 bottom
C271  1n  [0402-CAP]  175.88,102.23 180 bottom
C272  [0402-CAP]  135.23,218.36 90 top
C273  [0402-CAP]  133.8,218.36 270 top
C274  [0402-CAP]  138.88,214.07 0 top
C275  [0402-CAP]  134.44,216.61 0 top
C276  [0402-CAP]  133.96,206.45 0 top
C277  [0402-CAP]  128.56,215.98 0 top
C278  [0402-CAP]  127.13,217.25 0 top
C279  [0402-CAP]  126.18,215.98 0 top
C280  47u  [0805]  131.42,215.82 180 top
C281  [0402-CAP]  127.61,205.5 180 top
C282  [0402-CAP]  130.15,205.34 180 top
C283  [0402-CAP]  131.42,203.91 0 top
C284  0.1u  [0402]  93.45,90.53 270 bottom
C285  0.1u  [0402]  101.87,86.24 0 bottom
C286  1n  [0402]  102.5,89.42 270 bottom
C287  1n  [0402]  80.12,90.05 90 bottom
C288  0.1u  [0402]  84.72,87.35 270 top
C289  0.1u  [0603-CAP]  87.9,87.04 270 top
C290  22u  [0805]  58.37,90.53 0 bottom
C291  0.1u  [0402-CAP]  63.76,91.96 0 top
C292  0.1u  [0402-CAP]  67.11,86.76 0 bottom
C293  1n  [0402-CAP]  69.8,92.91 90 top
C308  0.1u  [0402-CAP]  166.34,95.01 90 bottom
C309  0.1u  [0402-CAP]  157.61,71.04 270 top
C310  10n  [0402-CAP']  124.75,114.22 90 top
C311  18p  [0402-CAP']  141.9,114.85 180 top
C312  18p  [0402-CAP']  144.75,114.85 0 top
C314  120n  [0402-CAP]  98.69,102.31 270 top
C315  0.1u  [0402-CAP]  88.05,104.53 180 top
C316  0.1u  [0402-CAP]  91.71,96.75 180 top
C317  0.1u  [0402]  71.23,104.85 0 bottom
C318  0.1u  [0402]  78.85,99.92 270 bottom
C319  0.1u  [0402]  93.45,104.53 270 bottom
C320  0.1u  [0402]  101.87,100.24 0 bottom
C321  1n  [0402]  102.5,103.42 270 bottom
C322  1n  [0402]  80.12,104.05 90 bottom
C323  0.1u  [0402]  84.72,101.35 270 top
C324  0.1u  [0603-CAP]  87.9,101.04 270 top
C325  22u  [0805]  58.37,104.53 0 bottom
C326  0.1u  [0402-CAP]  63.76,105.96 0 top
C327  0.1u  [0402-CAP]  67.11,100.76 0 bottom
C328  1n  [0402-CAP]  69.8,106.91 90 top
C344  120n  [0402-CAP]  98.69,116.31 270 top
C345  0.1u  [0402-CAP]  88.05,118.53 180 top
C346  0.1u  [0402-CAP]  91.71,110.75 180 top
C347  0.1u  [0402]  71.23,118.85 0 bottom
C348  0.1u  [0402]  78.85,113.92 270 bottom
C349  0.1u  [0402]  93.45,118.53 270 bottom
C350  0.1u  [0402]  101.87,114.24 0 bottom
C351  1n  [0402]  102.5,117.42 270 bottom
C352  1n  [0402]  80.12,118.05 90 bottom
C353  0.1u  [0402]  84.72,115.35 270 top
C354  0.1u  [0603-CAP]  87.9,115.04 270 top
C355  22u  [0805]  58.37,118.53 0 bottom
C356  0.1u  [0402-CAP]  63.76,119.96 0 top
C357  0.1u  [0402-CAP]  67.11,114.76 0 bottom
C358  1n  [0402-CAP]  69.8,120.91 90 top
C374  120n  [0402-CAP]  98.69,130.31 270 top
C375  0.1u  [0402-CAP]  88.05,132.53 180 top
C376  0.1u  [0402-CAP]  91.71,124.75 180 top
C377  0.1u  [0402]  71.23,132.85 0 bottom
C378  0.1u  [0402]  78.85,127.92 270 bottom
C379  0.1u  [0402]  93.45,132.53 270 bottom
C380  0.1u  [0402]  101.87,128.24 0 bottom
C381  1n  [0402]  102.5,131.42 270 bottom
C382  1n  [0402]  80.12,132.05 90 bottom
C383  0.1u  [0402]  84.72,129.35 270 top
C384  0.1u  [0603-CAP]  87.9,129.04 270 top
C385  22u  [0805]  58.37,132.53 0 bottom
C386  0.1u  [0402-CAP]  63.76,133.96 0 top
C387  0.1u  [0402-CAP]  67.11,128.76 0 bottom
C388  1n  [0402-CAP]  69.8,134.91 90 top
C404  120n  [0402-CAP]  98.69,144.31 270 top
C405  0.1u  [0402-CAP]  88.05,146.53 180 top
C406  0.1u  [0402-CAP]  91.71,138.75 180 top
C407  0.1u  [0402]  71.23,146.85 0 bottom
C408  0.1u  [0402]  78.85,141.92 270 bottom
C409  0.1u  [0402]  93.45,146.53 270 bottom
C410  0.1u  [0402]  101.87,142.24 0 bottom
C411  1n  [0402]  102.5,145.42 270 bottom
C412  1n  [0402]  80.12,146.05 90 bottom
C413  0.1u  [0402]  84.72,143.35 270 top
C414  0.1u  [0603-CAP]  87.9,143.04 270 top
C415  22u  [0805]  58.37,146.53 0 bottom
C416  0.1u  [0402-CAP]  63.76,147.96 0 top
C417  0.1u  [0402-CAP]  67.11,142.76 0 bottom
C418  1n  [0402-CAP]  69.8,148.91 90 top
C434  120n  [0402-CAP]  98.69,158.31 270 top
C435  0.1u  [0402-CAP]  88.05,160.53 180 top
C436  0.1u  [0402-CAP]  91.71,152.75 180 top
C437  0.1u  [0402]  71.23,160.85 0 bottom
C438  0.1u  [0402]  78.85,155.92 270 bottom
C439  0.1u  [0402]  93.45,160.53 270 bottom
C440  0.1u  [0402]  101.87,156.24 0 bottom
C441  1n  [0402]  102.5,159.42 270 bottom
C442  1n  [0402]  80.12,160.05 90 bottom
C443  0.1u  [0402]  84.72,157.35 270 top
C444  0.1u  [0603-CAP]  87.9,157.04 270 top
C445  22u  [0805]  58.37,160.53 0 bottom
C446  0.1u  [0402-CAP]  63.76,161.96 0 top
C447  0.1u  [0402-CAP]  67.11,156.76 0 bottom
C448  1n  [0402-CAP]  69.8,162.91 90 top
C464  120n  [0402-CAP]  98.69,172.31 270 top
C465  0.1u  [0402-CAP]  88.05,174.53 180 top
C466  0.1u  [0402-CAP]  91.71,166.75 180 top
C467  0.1u  [0402]  71.23,174.85 0 bottom
C468  0.1u  [0402]  78.85,169.92 270 bottom
C469  0.1u  [0402]  93.45,174.53 270 bottom
C470  0.1u  [0402]  101.87,170.24 0 bottom
C471  1n  [0402]  102.5,173.42 270 bottom
C472  1n  [0402]  80.12,174.05 90 bottom
C473  0.1u  [0402]  84.72,171.35 270 top
C474  0.1u  [0603-CAP]  87.9,171.04 270 top
C475  22u  [0805]  58.37,174.53 0 bottom
C476  0.1u  [0402-CAP]  63.76,175.96 0 top
C477  0.1u  [0402-CAP]  67.11,170.76 0 bottom
C478  1n  [0402-CAP]  69.8,176.91 90 top
C494  120n  [0402-CAP]  98.69,186.31 270 top
C495  0.1u  [0402-CAP]  88.05,188.53 180 top
C496  0.1u  [0402-CAP]  91.71,180.75 180 top
C497  0.1u  [0402]  71.23,188.85 0 bottom
C498  0.1u  [0402]  78.85,183.92 270 bottom
C499  0.1u  [0402]  93.45,188.53 270 bottom
C500  0.1u  [0402]  101.87,184.24 0 bottom
C501  1n  [0402]  102.5,187.42 270 bottom
C502  1n  [0402]  80.12,188.05 90 bottom
C503  0.1u  [0402]  84.72,185.35 270 top
C504  0.1u  [0603-CAP]  87.9,185.04 270 top
C505  22u  [0805]  58.37,188.53 0 bottom
C506  0.1u  [0402-CAP]  63.76,189.96 0 top
C507  0.1u  [0402-CAP]  67.11,184.76 0 bottom
C508  1n  [0402-CAP]  69.8,190.91 90 top
C524  120n  [0402-CAP]  98.69,200.31 270 top
C525  0.1u  [0402-CAP]  88.05,202.53 180 top
C526  0.1u  [0402-CAP]  91.71,194.75 180 top
C527  0.1u  [0402]  71.23,202.85 0 bottom
C528  0.1u  [0402]  78.85,197.92 270 bottom
C529  0.1u  [0402]  93.45,202.53 270 bottom
C530  0.1u  [0402]  101.87,198.24 0 bottom
C531  1n  [0402]  102.5,201.42 270 bottom
C532  1n  [0402]  80.12,202.05 90 bottom
C533  0.1u  [0402]  84.72,199.35 270 top
C534  0.1u  [0603-CAP]  87.9,199.04 270 top
C535  22u  [0805]  58.37,202.53 0 bottom
C536  0.1u  [0402-CAP]  63.76,203.96 0 top
C537  0.1u  [0402-CAP]  67.11,198.76 0 bottom
C538  1n  [0402-CAP]  69.8,204.91 90 top
C554  120n  [0402-CAP]  98.69,214.31 270 top
C555  0.1u  [0402-CAP]  88.05,216.53 180 top
C556  0.1u  [0402-CAP]  91.71,208.75 180 top
C557  0.1u  [0402]  71.23,216.85 0 bottom
C558  0.1u  [0402]  78.85,211.92 270 bottom
C559  0.1u  [0402]  93.45,216.53 270 bottom
C560  0.1u  [0402]  101.87,212.24 0 bottom
C561  1n  [0402]  102.5,215.42 270 bottom
C562  1n  [0402]  80.12,216.05 90 bottom
C563  0.1u  [0402]  84.72,213.35 270 top
C564  0.1u  [0603-CAP]  87.9,213.04 270 top
C565  22u  [0805]  58.37,216.53 0 bottom
C566  0.1u  [0402-CAP]  63.76,217.96 0 top
C567  0.1u  [0402-CAP]  67.11,212.76 0 bottom
C568  1n  [0402-CAP]  69.8,218.91 90 top
C584  120n  [0402-CAP]  98.69,228.31 270 top
C585  0.1u  [0402-CAP]  88.05,230.53 180 top
C586  0.1u  [0402-CAP]  91.71,222.75 180 top
C587  0.1u  [0402]  71.23,230.85 0 bottom
C588  0.1u  [0402]  78.85,225.92 270 bottom
C589  0.1u  [0402]  93.45,230.53 270 bottom
C590  0.1u  [0402]  101.87,226.24 0 bottom
C591  1n  [0402]  102.5,229.42 270 bottom
C592  1n  [0402]  80.12,230.05 90 bottom
C593  0.1u  [0402]  84.72,227.35 270 top
C594  0.1u  [0603-CAP]  87.9,227.04 270 top
C595  22u  [0805]  58.37,230.53 0 bottom
C596  0.1u  [0402-CAP]  63.76,231.96 0 top
C597  0.1u  [0402-CAP]  67.11,226.76 0 bottom
C598  1n  [0402-CAP]  69.8,232.91 90 top
CN1  SWD  [CONNETTORI_PINHEAD-2X5-P127]  136.34,176.93 270 top
CN2  SWD  [CONNETTORI_PINHEAD-2X5-P127]  179.05,85.64 180 top
D1  BAT20JFILM  [SOD-323]  167.58,223.16 0 top
D2  BAT20JFILM  [SOD-323]  167.58,224.75 180 top
D3  BAT20JFILM  [SOD-323]  193.61,17.26 270 top
D9  BAT20JFILM  [SOD-323]  36.46,16.56 180 bottom
D10  BAT20JFILM  [SOD-323]  36.46,18.15 0 bottom
D11  BAT20JFILM  [SOD-323]  42.65,13.38 180 bottom
D12  BAT20JFILM  [SOD-323]  14.39,14.97 0 bottom
D13  BAT20JFILM  [SOD-323]  14.39,13.38 180 bottom
D14  BAT20JFILM  [SOD-323]  13.6,21.96 0 bottom
D15  BAT20JFILM  [SOD-323]  13.6,20.37 180 bottom
D16  TVSSMA  [SMA-DIODE]  20.27,19.26 270 bottom
D17  TVSSMA  [SMA-DIODE]  24.87,22.12 270 bottom
D18  BAT20JFILM  [SOD-323]  36.46,30.56 180 bottom
D19  BAT20JFILM  [SOD-323]  36.46,32.15 0 bottom
D20  BAT20JFILM  [SOD-323]  42.65,27.38 180 bottom
D21  BAT20JFILM  [SOD-323]  174.56,223.64 270 top
D22  BAT20JFILM  [SOD-323]  14.39,28.97 0 bottom
D23  BAT20JFILM  [SOD-323]  14.39,27.38 180 bottom
D24  BAT20JFILM  [SOD-323]  13.6,35.96 0 bottom
D25  BAT20JFILM  [SOD-323]  13.6,34.37 180 bottom
D26  TVSSMA  [SMA-DIODE]  20.27,33.26 270 bottom
D27  TVSSMA  [SMA-DIODE]  24.87,36.12 270 bottom
D31  BAT20JFILM  [SOD-323]  172.98,223.64 90 top
D32  BAT20JFILM  [SOD-323]  169.73,209.02 0 top
D33  BAT20JFILM  [SOD-323]  169.77,207.4 180 top
D41  BAT20JFILM  [SOD-323]  36.46,44.56 180 bottom
D42  BAT20JFILM  [SOD-323]  36.46,46.15 0 bottom
D43  BAT20JFILM  [SOD-323]  42.65,41.38 180 bottom
D44  BAT20JFILM  [SOD-323]  14.39,42.97 0 bottom
D45  BAT20JFILM  [SOD-323]  14.39,41.38 180 bottom
D46  BAT20JFILM  [SOD-323]  13.6,49.96 0 bottom
D47  BAT20JFILM  [SOD-323]  13.6,48.37 180 bottom
D51  TVSSMA  [SMA-DIODE]  20.27,47.26 270 bottom
D52  TVSSMA  [SMA-DIODE]  24.87,50.12 270 bottom
D62  BAT20JFILM  [SOD-323]  36.46,58.56 180 bottom
D63  BAT20JFILM  [SOD-323]  36.46,60.15 0 bottom
D64  BAT20JFILM  [SOD-323]  42.65,55.38 180 bottom
D65  BAT20JFILM  [SOD-323]  14.39,56.97 0 bottom
D66  BAT20JFILM  [SOD-323]  14.39,55.38 180 bottom
D67  BAT20JFILM  [SOD-323]  13.6,63.96 0 bottom
D68  BAT20JFILM  [SOD-323]  13.6,62.37 180 bottom
D69  TVSSMA  [SMA-DIODE]  20.27,61.26 270 bottom
D70  TVSSMA  [SMA-DIODE]  24.87,64.12 270 bottom
D80  BAT20JFILM  [SOD-323]  36.46,72.56 180 bottom
D81  BAT20JFILM  [SOD-323]  36.46,74.15 0 bottom
D82  BAT20JFILM  [SOD-323]  42.65,69.38 180 bottom
D83  BAT20JFILM  [SOD-323]  14.39,70.97 0 bottom
D84  BAT20JFILM  [SOD-323]  14.39,69.38 180 bottom
D85  BAT20JFILM  [SOD-323]  13.6,77.96 0 bottom
D86  BAT20JFILM  [SOD-323]  13.6,76.37 180 bottom
D87  TVSSMA  [SMA-DIODE]  20.27,75.26 270 bottom
D88  TVSSMA  [SMA-DIODE]  24.87,78.12 270 bottom
D98  BAT20JFILM  [SOD-323]  36.46,86.56 180 bottom
D99  BAT20JFILM  [SOD-323]  36.46,88.15 0 bottom
D100  BAT20JFILM  [SOD-323]  42.65,83.38 180 bottom
D101  BAT20JFILM  [SOD-323]  14.39,84.97 0 bottom
D102  BAT20JFILM  [SOD-323]  14.39,83.38 180 bottom
D103  BAT20JFILM  [SOD-323]  13.6,91.96 0 bottom
D104  BAT20JFILM  [SOD-323]  13.6,90.37 180 bottom
D105  TVSSMA  [SMA-DIODE]  20.27,89.26 270 bottom
D106  TVSSMA  [SMA-DIODE]  24.87,92.12 270 bottom
D116  BAT20JFILM  [SOD-323]  36.46,100.56 180 bottom
D117  BAT20JFILM  [SOD-323]  36.46,102.15 0 bottom
D118  BAT20JFILM  [SOD-323]  42.65,97.38 180 bottom
D119  BAT20JFILM  [SOD-323]  14.39,98.97 0 bottom
D120  BAT20JFILM  [SOD-323]  14.39,97.38 180 bottom
D121  BAT20JFILM  [SOD-323]  13.6,105.96 0 bottom
D122  BAT20JFILM  [SOD-323]  13.6,104.37 180 bottom
D123  TVSSMA  [SMA-DIODE]  20.27,103.26 270 bottom
D124  TVSSMA  [SMA-DIODE]  24.87,106.12 270 bottom
D134  BAT20JFILM  [SOD-323]  36.46,114.56 180 bottom
D135  BAT20JFILM  [SOD-323]  36.46,116.15 0 bottom
D136  BAT20JFILM  [SOD-323]  42.65,111.38 180 bottom
D137  BAT20JFILM  [SOD-323]  14.39,112.97 0 bottom
D138  BAT20JFILM  [SOD-323]  14.39,111.38 180 bottom
D139  BAT20JFILM  [SOD-323]  13.6,119.96 0 bottom
D140  BAT20JFILM  [SOD-323]  13.6,118.37 180 bottom
D141  TVSSMA  [SMA-DIODE]  20.27,117.26 270 bottom
D142  TVSSMA  [SMA-DIODE]  24.87,120.12 270 bottom
D145  BAT20J  [SOD-323]  123.48,117.71 270 top
D146  BAT20J  [SOD-323]  121.9,117.71 90 top
D147  BAT20J  [SOD-323]  123.64,115.97 180 bottom
D148  BAT20JFILM  [SOD-323]  134.33,102.08 90 bottom
D149  BAT20JFILM  [SOD-323]  136.02,102.08 270 bottom
D150  BAT20JFILM  [SOD-323]  134.33,98.38 270 bottom
D151  BAT20JFILM  [SOD-323]  136.02,98.38 90 bottom
D152  250mA/100V  [SOD-323]  142.06,181.85 270 top
D153  GREEN  [LED-0603]  139.36,172.32 90 top
D154  RED  [LED-0603]  171.9,82.47 180 top
D155  RED  [LED-0603]  193.58,11.91 180 top
D156  GREEN  [LED-0603]  200.48,60.24 90 top
D157  RED  [LED-0603]  202.7,36.27 270 top
D158  250mA/100V  [SOD-323]  192.31,24.29 90 top
D159  TVSSMA  [SMA-DIODE]  199.21,52.94 90 bottom
D160  TVSSMA  [SMA-DIODE]  199.21,42.78 90 bottom
D161  B340A  [SMA-DIODE]  185.63,55.13 180 top
D162  B340A  [SMA-DIODE]  185.71,39.31 180 top
D163  BAT20JFILM  [SOD-323]  169.02,166.6 270 bottom
D164  GREEN  [LED-0603]  163.03,157.81 0 top
D165  BAT20JFILM  [SOD-323]  168.63,133.97 270 bottom
D166  GREEN  [LED-0603]  163.49,124.3 0 top
D167  250mA/100V  [SOD-323]  153.84,21.89 270 bottom
D168  GREEN  [LED-0603]  151.11,29.51 90 top
D169  250mA/100V  [SOD-323]  183.55,21.89 270 bottom
D170  GREEN  [LED-0603]  177.01,29.51 90 top
D171  GREEN  [LED-0603]  150.47,208.2 90 top
D172  RED  [LED-0603]  150.47,212.01 90 top
D180  BAT20JFILM  [SOD-323]  36.46,128.56 180 bottom
D181  BAT20JFILM  [SOD-323]  36.46,130.15 0 bottom
D182  BAT20JFILM  [SOD-323]  42.65,125.38 180 bottom
D183  BAT20JFILM  [SOD-323]  14.39,126.97 0 bottom
D184  BAT20JFILM  [SOD-323]  14.39,125.38 180 bottom
D185  BAT20JFILM  [SOD-323]  13.6,133.96 0 bottom
D186  BAT20JFILM  [SOD-323]  13.6,132.37 180 bottom
D187  TVSSMA  [SMA-DIODE]  20.27,131.26 270 bottom
D188  TVSSMA  [SMA-DIODE]  24.87,134.12 270 bottom
D198  BAT20JFILM  [SOD-323]  36.46,142.56 180 bottom
D199  BAT20JFILM  [SOD-323]  36.46,144.15 0 bottom
D200  BAT20JFILM  [SOD-323]  42.65,139.38 180 bottom
D201  BAT20JFILM  [SOD-323]  14.39,140.97 0 bottom
D202  BAT20JFILM  [SOD-323]  14.39,139.38 180 bottom
D203  BAT20JFILM  [SOD-323]  13.6,147.96 0 bottom
D204  BAT20JFILM  [SOD-323]  13.6,146.37 180 bottom
D205  TVSSMA  [SMA-DIODE]  20.27,145.26 270 bottom
D206  TVSSMA  [SMA-DIODE]  24.87,148.12 270 bottom
D216  BAT20JFILM  [SOD-323]  36.46,156.56 180 bottom
D217  BAT20JFILM  [SOD-323]  36.46,158.15 0 bottom
D218  BAT20JFILM  [SOD-323]  42.65,153.38 180 bottom
D219  BAT20JFILM  [SOD-323]  14.39,154.97 0 bottom
D220  BAT20JFILM  [SOD-323]  14.39,153.38 180 bottom
D221  BAT20JFILM  [SOD-323]  13.6,161.96 0 bottom
D222  BAT20JFILM  [SOD-323]  13.6,160.37 180 bottom
D223  TVSSMA  [SMA-DIODE]  20.27,159.26 270 bottom
D224  TVSSMA  [SMA-DIODE]  24.87,162.12 270 bottom
D234  BAT20JFILM  [SOD-323]  36.46,170.56 180 bottom
D235  BAT20JFILM  [SOD-323]  36.46,172.15 0 bottom
D236  BAT20JFILM  [SOD-323]  42.65,167.38 180 bottom
D237  BAT20JFILM  [SOD-323]  14.39,168.97 0 bottom
D238  BAT20JFILM  [SOD-323]  14.39,167.38 180 bottom
D239  BAT20JFILM  [SOD-323]  13.6,175.96 0 bottom
D240  BAT20JFILM  [SOD-323]  13.6,174.37 180 bottom
D241  TVSSMA  [SMA-DIODE]  20.27,173.26 270 bottom
D242  TVSSMA  [SMA-DIODE]  24.87,176.12 270 bottom
D252  BAT20JFILM  [SOD-323]  36.46,184.56 180 bottom
D253  BAT20JFILM  [SOD-323]  36.46,186.15 0 bottom
D254  BAT20JFILM  [SOD-323]  42.65,181.38 180 bottom
D255  BAT20JFILM  [SOD-323]  14.39,182.97 0 bottom
D256  BAT20JFILM  [SOD-323]  14.39,181.38 180 bottom
D257  BAT20JFILM  [SOD-323]  13.6,189.96 0 bottom
D258  BAT20JFILM  [SOD-323]  13.6,188.37 180 bottom
D259  TVSSMA  [SMA-DIODE]  20.27,187.26 270 bottom
D260  TVSSMA  [SMA-DIODE]  24.87,190.12 270 bottom
D270  BAT20JFILM  [SOD-323]  36.46,198.56 180 bottom
D271  BAT20JFILM  [SOD-323]  36.46,200.15 0 bottom
D272  BAT20JFILM  [SOD-323]  42.65,195.38 180 bottom
D273  BAT20JFILM  [SOD-323]  14.39,196.97 0 bottom
D274  BAT20JFILM  [SOD-323]  14.39,195.38 180 bottom
D275  BAT20JFILM  [SOD-323]  13.6,203.96 0 bottom
D276  BAT20JFILM  [SOD-323]  13.6,202.37 180 bottom
D277  TVSSMA  [SMA-DIODE]  20.27,201.26 270 bottom
D278  TVSSMA  [SMA-DIODE]  24.87,204.12 270 bottom
D288  BAT20JFILM  [SOD-323]  36.46,212.56 180 bottom
D289  BAT20JFILM  [SOD-323]  36.46,214.15 0 bottom
D290  BAT20JFILM  [SOD-323]  42.65,209.38 180 bottom
D291  BAT20JFILM  [SOD-323]  14.39,210.97 0 bottom
D292  BAT20JFILM  [SOD-323]  14.39,209.38 180 bottom
D293  BAT20JFILM  [SOD-323]  13.6,217.96 0 bottom
D294  BAT20JFILM  [SOD-323]  13.6,216.37 180 bottom
D295  TVSSMA  [SMA-DIODE]  20.27,215.26 270 bottom
D296  TVSSMA  [SMA-DIODE]  24.87,218.12 270 bottom
D306  BAT20JFILM  [SOD-323]  36.46,226.56 180 bottom
D307  BAT20JFILM  [SOD-323]  36.46,228.15 0 bottom
D308  BAT20JFILM  [SOD-323]  42.65,223.38 180 bottom
D309  BAT20JFILM  [SOD-323]  14.39,224.97 0 bottom
D310  BAT20JFILM  [SOD-323]  14.39,223.38 180 bottom
D311  BAT20JFILM  [SOD-323]  13.6,231.96 0 bottom
D312  BAT20JFILM  [SOD-323]  13.6,230.37 180 bottom
D313  TVSSMA  [SMA-DIODE]  20.27,229.26 270 bottom
D314  TVSSMA  [SMA-DIODE]  24.87,232.12 270 bottom
F1  [PTC0805]  190.6,58.45 180 top
F2  [PTC0805]  190.38,37.99 180 top
FB1  BLM18PG471SN1  [_0603MP]  148.88,168.83 270 top
FB2  BLM18PG471SN1  [_0603MP]  175.24,74.53 180 top
FB3  BLM18PG471SN1  [_0603MP]  192.38,64.53 180 top
IC2  OPA237U  [SO08]  91.71,17.51 180 top
IC3  INA118U  [SO08]  74.4,17.67 90 bottom
IC4  INA118U  [SO08]  96.63,16.72 90 bottom
IC5  OPA237U  [SO08]  91.71,31.51 180 top
IC6  INA118U  [SO08]  74.4,31.67 90 bottom
IC7  INA118U  [SO08]  96.63,30.72 90 bottom
IC8  INA118U  [SO08]  169.01,218.24 180 top
IC12  OPA237U  [SO08]  91.71,45.51 180 top
IC13  INA118U  [SO08]  74.4,45.67 90 bottom
IC14  INA118U  [SO08]  96.63,44.72 90 bottom
IC18  OPA237U  [SO08]  91.71,59.51 180 top
IC19  INA118U  [SO08]  74.4,59.67 90 bottom
IC20  INA118U  [SO08]  96.63,58.72 90 bottom
IC24  OPA237U  [SO08]  91.71,73.51 180 top
IC25  INA118U  [SO08]  74.4,73.67 90 bottom
IC26  INA118U  [SO08]  96.63,72.72 90 bottom
IC30  OPA237U  [SO08]  91.71,87.51 180 top
IC31  INA118U  [SO08]  74.4,87.67 90 bottom
IC32  INA118U  [SO08]  96.63,86.72 90 bottom
IC36  OPA237U  [SO08]  91.71,101.51 180 top
IC37  INA118U  [SO08]  74.4,101.67 90 bottom
IC38  INA118U  [SO08]  96.63,100.72 90 bottom
IC44  OPA237U  [SO08]  91.71,115.51 180 top
IC45  INA118U  [SO08]  74.4,115.67 90 bottom
IC46  INA118U  [SO08]  96.63,114.72 90 bottom
IC49  MAX306CWI  [SO28L]  133.96,158.51 180 bottom
IC50  OPA137  [SOT23-5]  140.94,98.82 180 top
IC51  MAX306CWI  [SO28L]  133.96,79.77 180 bottom
IC53  OPA237U  [SO08]  91.71,129.51 180 top
IC54  INA118U  [SO08]  74.4,129.67 90 bottom
IC55  INA118U  [SO08]  96.63,128.72 90 bottom
IC59  OPA237U  [SO08]  91.71,143.51 180 top
IC60  INA118U  [SO08]  74.4,143.67 90 bottom
IC61  INA118U  [SO08]  96.63,142.72 90 bottom
IC65  OPA237U  [SO08]  91.71,157.51 180 top
IC66  INA118U  [SO08]  74.4,157.67 90 bottom
IC67  INA118U  [SO08]  96.63,156.72 90 bottom
IC71  OPA237U  [SO08]  91.71,171.51 180 top
IC72  INA118U  [SO08]  74.4,171.67 90 bottom
IC73  INA118U  [SO08]  96.63,170.72 90 bottom
IC77  OPA237U  [SO08]  91.71,185.51 180 top
IC78  INA118U  [SO08]  74.4,185.67 90 bottom
IC79  INA118U  [SO08]  96.63,184.72 90 bottom
IC83  OPA237U  [SO08]  91.71,199.51 180 top
IC84  INA118U  [SO08]  74.4,199.67 90 bottom
IC85  INA118U  [SO08]  96.63,198.72 90 bottom
IC89  OPA237U  [SO08]  91.71,213.51 180 top
IC90  INA118U  [SO08]  74.4,213.67 90 bottom
IC91  INA118U  [SO08]  96.63,212.72 90 bottom
IC95  OPA237U  [SO08]  91.71,227.51 180 top
IC96  INA118U  [SO08]  74.4,227.67 90 bottom
IC97  INA118U  [SO08]  96.63,226.72 90 bottom
J1  [1X02]  201.43,85.33 90 top
J3  [2X5-SHROUDED]  123.13,232.37 270 top
JP2  JUMPER-PAD-2-NC_BY_PASTE  [PAD-JUMPER-2-NC_BY_PASTE_YES_SILK]  122.65,27.74 270 top
JP6  JUMPER-PAD-3-NC_BY_PASTE  [PAD-JUMPER-3-NC_BY_PASTE_YES_SILK_FULL_BOX]  99.17,20.37 180 bottom
JP7  JUMPER-PAD-3-NC_BY_PASTE  [PAD-JUMPER-3-NC_BY_PASTE_YES_SILK_FULL_BOX]  95.99,20.37 180 bottom
JP8  JUMPER-PAD-3-NC_BY_PASTE  [PAD-JUMPER-3-NC_BY_PASTE_YES_SILK_FULL_BOX]  85.36,22.91 0 top
JP9  JUMPER-PAD-3-NC_BY_PASTE  [PAD-JUMPER-3-NC_BY_PASTE_YES_SILK_FULL_BOX]  99.17,34.37 180 bottom
JP10  JUMPER-PAD-3-NC_BY_PASTE  [PAD-JUMPER-3-NC_BY_PASTE_YES_SILK_FULL_BOX]  95.99,34.37 180 bottom
JP11  JUMPER-PAD-3-NC_BY_PASTE  [PAD-JUMPER-3-NC_BY_PASTE_YES_SILK_FULL_BOX]  85.36,36.91 0 top
JP15  JUMPER-PAD-3-NC_BY_PASTE  [PAD-JUMPER-3-NC_BY_PASTE_YES_SILK_FULL_BOX]  99.17,48.37 180 bottom
JP16  JUMPER-PAD-3-NC_BY_PASTE  [PAD-JUMPER-3-NC_BY_PASTE_YES_SILK_FULL_BOX]  95.99,48.37 180 bottom
JP17  JUMPER-PAD-3-NC_BY_PASTE  [PAD-JUMPER-3-NC_BY_PASTE_YES_SILK_FULL_BOX]  85.36,50.91 0 top
JP21  JUMPER-PAD-3-NC_BY_PASTE  [PAD-JUMPER-3-NC_BY_PASTE_YES_SILK_FULL_BOX]  99.17,62.37 180 bottom
JP22  JUMPER-PAD-3-NC_BY_PASTE  [PAD-JUMPER-3-NC_BY_PASTE_YES_SILK_FULL_BOX]  95.99,62.37 180 bottom
JP23  JUMPER-PAD-3-NC_BY_PASTE  [PAD-JUMPER-3-NC_BY_PASTE_YES_SILK_FULL_BOX]  85.36,64.91 0 top
JP27  JUMPER-PAD-3-NC_BY_PASTE  [PAD-JUMPER-3-NC_BY_PASTE_YES_SILK_FULL_BOX]  99.17,76.37 180 bottom
JP28  JUMPER-PAD-3-NC_BY_PASTE  [PAD-JUMPER-3-NC_BY_PASTE_YES_SILK_FULL_BOX]  95.99,76.37 180 bottom
JP29  JUMPER-PAD-3-NC_BY_PASTE  [PAD-JUMPER-3-NC_BY_PASTE_YES_SILK_FULL_BOX]  85.36,78.91 0 top
JP33  JUMPER-PAD-3-NC_BY_PASTE  [PAD-JUMPER-3-NC_BY_PASTE_YES_SILK_FULL_BOX]  99.17,90.37 180 bottom
JP34  JUMPER-PAD-3-NC_BY_PASTE  [PAD-JUMPER-3-NC_BY_PASTE_YES_SILK_FULL_BOX]  95.99,90.37 180 bottom
JP35  JUMPER-PAD-3-NC_BY_PASTE  [PAD-JUMPER-3-NC_BY_PASTE_YES_SILK_FULL_BOX]  85.36,92.91 0 top
JP39  JUMPER-PAD-3-NC_BY_PASTE  [PAD-JUMPER-3-NC_BY_PASTE_YES_SILK_FULL_BOX]  99.17,104.37 180 bottom
JP40  JUMPER-PAD-3-NC_BY_PASTE  [PAD-JUMPER-3-NC_BY_PASTE_YES_SILK_FULL_BOX]  95.99,104.37 180 bottom
JP41  JUMPER-PAD-3-NC_BY_PASTE  [PAD-JUMPER-3-NC_BY_PASTE_YES_SILK_FULL_BOX]  85.36,106.91 0 top
JP45  JUMPER-PAD-3-NC_BY_PASTE  [PAD-JUMPER-3-NC_BY_PASTE_YES_SILK_FULL_BOX]  99.17,118.37 180 bottom
JP46  JUMPER-PAD-3-NC_BY_PASTE  [PAD-JUMPER-3-NC_BY_PASTE_YES_SILK_FULL_BOX]  95.99,118.37 180 bottom
JP47  JUMPER-PAD-3-NC_BY_PASTE  [PAD-JUMPER-3-NC_BY_PASTE_YES_SILK_FULL_BOX]  85.36,120.91 0 top
JP51  JUMPER-PAD-3-NC_BY_PASTE  [PAD-JUMPER-3-NC_BY_PASTE_YES_SILK_FULL_BOX]  99.17,132.37 180 bottom
JP52  JUMPER-PAD-3-NC_BY_PASTE  [PAD-JUMPER-3-NC_BY_PASTE_YES_SILK_FULL_BOX]  95.99,132.37 180 bottom
JP53  JUMPER-PAD-3-NC_BY_PASTE  [PAD-JUMPER-3-NC_BY_PASTE_YES_SILK_FULL_BOX]  85.36,134.91 0 top
JP57  JUMPER-PAD-3-NC_BY_PASTE  [PAD-JUMPER-3-NC_BY_PASTE_YES_SILK_FULL_BOX]  99.17,146.37 180 bottom
JP58  JUMPER-PAD-3-NC_BY_PASTE  [PAD-JUMPER-3-NC_BY_PASTE_YES_SILK_FULL_BOX]  95.99,146.37 180 bottom
JP59  JUMPER-PAD-3-NC_BY_PASTE  [PAD-JUMPER-3-NC_BY_PASTE_YES_SILK_FULL_BOX]  85.36,148.91 0 top
JP63  JUMPER-PAD-3-NC_BY_PASTE  [PAD-JUMPER-3-NC_BY_PASTE_YES_SILK_FULL_BOX]  99.17,160.37 180 bottom
JP64  JUMPER-PAD-3-NC_BY_PASTE  [PAD-JUMPER-3-NC_BY_PASTE_YES_SILK_FULL_BOX]  95.99,160.37 180 bottom
JP65  JUMPER-PAD-3-NC_BY_PASTE  [PAD-JUMPER-3-NC_BY_PASTE_YES_SILK_FULL_BOX]  85.36,162.91 0 top
JP69  JUMPER-PAD-3-NC_BY_PASTE  [PAD-JUMPER-3-NC_BY_PASTE_YES_SILK_FULL_BOX]  99.17,174.37 180 bottom
JP70  JUMPER-PAD-3-NC_BY_PASTE  [PAD-JUMPER-3-NC_BY_PASTE_YES_SILK_FULL_BOX]  95.99,174.37 180 bottom
JP71  JUMPER-PAD-3-NC_BY_PASTE  [PAD-JUMPER-3-NC_BY_PASTE_YES_SILK_FULL_BOX]  85.36,176.91 0 top
JP75  JUMPER-PAD-3-NC_BY_PASTE  [PAD-JUMPER-3-NC_BY_PASTE_YES_SILK_FULL_BOX]  99.17,188.37 180 bottom
JP76  JUMPER-PAD-3-NC_BY_PASTE  [PAD-JUMPER-3-NC_BY_PASTE_YES_SILK_FULL_BOX]  95.99,188.37 180 bottom
JP77  JUMPER-PAD-3-NC_BY_PASTE  [PAD-JUMPER-3-NC_BY_PASTE_YES_SILK_FULL_BOX]  85.36,190.91 0 top
JP81  JUMPER-PAD-3-NC_BY_PASTE  [PAD-JUMPER-3-NC_BY_PASTE_YES_SILK_FULL_BOX]  99.17,202.37 180 bottom
JP82  JUMPER-PAD-3-NC_BY_PASTE  [PAD-JUMPER-3-NC_BY_PASTE_YES_SILK_FULL_BOX]  95.99,202.37 180 bottom
JP83  JUMPER-PAD-3-NC_BY_PASTE  [PAD-JUMPER-3-NC_BY_PASTE_YES_SILK_FULL_BOX]  85.36,204.91 0 top
JP87  JUMPER-PAD-3-NC_BY_PASTE  [PAD-JUMPER-3-NC_BY_PASTE_YES_SILK_FULL_BOX]  99.17,216.37 180 bottom
JP88  JUMPER-PAD-3-NC_BY_PASTE  [PAD-JUMPER-3-NC_BY_PASTE_YES_SILK_FULL_BOX]  95.99,216.37 180 bottom
JP89  JUMPER-PAD-3-NC_BY_PASTE  [PAD-JUMPER-3-NC_BY_PASTE_YES_SILK_FULL_BOX]  85.36,218.91 0 top
JP93  JUMPER-PAD-3-NC_BY_PASTE  [PAD-JUMPER-3-NC_BY_PASTE_YES_SILK_FULL_BOX]  99.17,230.37 180 bottom
JP94  JUMPER-PAD-3-NC_BY_PASTE  [PAD-JUMPER-3-NC_BY_PASTE_YES_SILK_FULL_BOX]  95.99,230.37 180 bottom
JP95  JUMPER-PAD-3-NC_BY_PASTE  [PAD-JUMPER-3-NC_BY_PASTE_YES_SILK_FULL_BOX]  85.36,232.91 0 top
K1  DSBT2-M-2D-DC1.5V  [DS-BT]  36.46,17.19 180 top
K2  DSBT2-M-2D-DC1.5V  [DS-BT]  36.46,31.19 180 top
K3  AQW21SOP  [SOP08]  180.75,218.56 270 top
K4  DSBT2-M-2D-DC1.5V  [DS-BT]  36.46,45.19 180 top
K5  RT424005  [RT2C/O]  179.01,172.36 0 top
K6  DSBT2-M-2D-DC1.5V  [DS-BT]  36.46,59.19 180 top
K7  RT424005  [RT2C/O]  179.17,139.66 0 top
K8  DSBT2-M-2D-DC1.5V  [DS-BT]  36.46,73.19 180 top
K10  DSBT2-M-2D-DC1.5V  [DS-BT]  36.46,87.19 180 top
K12  DSBT2-M-2D-DC1.5V  [DS-BT]  36.46,101.19 180 top
K14  DSBT2-M-2D-DC1.5V  [DS-BT]  36.46,115.19 180 top
K17  AQY41SOP  [SOP04]  177.46,56.12 270 top
K18  AQW21SOP  [SOP08]  181.01,195.4 270 top
K19  RT424005  [RT2C/O]  179.06,156.03 0 top
K20  RT424005  [RT2C/O]  179.23,123.32 0 top
K21  RT424005  [RT2C/O]  141.2,21.89 180 top
K22  RT424005  [RT2C/O]  170.92,21.89 180 top
K23  DSBT2-M-2D-DC1.5V  [DS-BT]  36.46,129.19 180 top
K25  DSBT2-M-2D-DC1.5V  [DS-BT]  36.46,143.19 180 top
K27  DSBT2-M-2D-DC1.5V  [DS-BT]  36.46,157.19 180 top
K29  DSBT2-M-2D-DC1.5V  [DS-BT]  36.46,171.19 180 top
K31  DSBT2-M-2D-DC1.5V  [DS-BT]  36.46,185.19 180 top
K33  DSBT2-M-2D-DC1.5V  [DS-BT]  36.46,199.19 180 top
K35  DSBT2-M-2D-DC1.5V  [DS-BT]  36.46,213.19 180 top
K37  DSBT2-M-2D-DC1.5V  [DS-BT]  36.46,227.19 180 top
L2  COMMONMODEFILTER2014  [2014]  190.88,54.91 90 top
L3  COMMONMODEFILTER2014  [2014]  190.71,41.54 90 top
L4  47uH  [CR54]  185.52,50.24 0 top
L5  47uH  [CR54]  185.52,43.96 180 top
LED1  GREEN  [CHIPLED_0603]  82.18,13.7 180 top
LED2  GREEN  [CHIPLED_0603]  82.18,27.7 180 top
LED4  GREEN  [CHIPLED_0603]  82.18,41.7 180 top
LED6  GREEN  [CHIPLED_0603]  82.18,55.7 180 top
LED8  GREEN  [CHIPLED_0603]  82.18,69.7 180 top
LED10  GREEN  [CHIPLED_0603]  82.18,83.7 180 top
LED12  GREEN  [CHIPLED_0603]  82.18,97.7 180 top
LED15  GREEN  [CHIPLED_0603]  82.18,111.7 180 top
LED17  GREEN  [CHIPLED_0603]  82.18,125.7 180 top
LED19  GREEN  [CHIPLED_0603]  82.18,139.7 180 top
LED21  GREEN  [CHIPLED_0603]  82.18,153.7 180 top
LED23  GREEN  [CHIPLED_0603]  82.18,167.7 180 top
LED25  GREEN  [CHIPLED_0603]  82.18,181.7 180 top
LED27  GREEN  [CHIPLED_0603]  82.18,195.7 180 top
LED29  GREEN  [CHIPLED_0603]  82.18,209.7 180 top
LED31  GREEN  [CHIPLED_0603]  82.18,223.7 180 top
Q1  MOSFET-NCHANNELAO3404A  [SOT23-3]  85.99,13.7 90 top
Q2  MOSFET-NCHANNELAO3404A  [SOT23-3]  85.99,27.7 90 top
Q4  MOSFET-NCHANNELAO3404A  [SOT23-3]  85.99,41.7 90 top
Q6  MOSFET-NCHANNELAO3404A  [SOT23-3]  85.99,55.7 90 top
Q8  MOSFET-NCHANNELAO3404A  [SOT23-3]  85.99,69.7 90 top
Q10  MOSFET-NCHANNELAO3404A  [SOT23-3]  85.99,83.7 90 top
Q12  MOSFET-NCHANNELAO3404A  [SOT23-3]  85.99,97.7 90 top
Q15  MOSFET-NCHANNELAO3404A  [SOT23-3]  85.99,111.7 90 top
Q17  MOSFET-NCHANNELAO3404A  [SOT23-3]  143.17,163.11 270 top
Q18  MOSFET-NCHANNELAO3404A  [SOT23-3]  197.94,83.74 90 top
Q19  FC-12M  [FC-12M]  145.23,171.21 90 top
Q20  MOSFET-NCHANNELAO3404A  [SOT23-3]  124.44,49.77 180 top
Q21  MOSFET-NCHANNELAO3404A  [SOT23-3]  124.44,53.74 180 top
Q22  MOSFET-NCHANNELAO3404A  [SOT23-3]  85.99,125.7 90 top
Q23  MOSFET-NCHANNELAO3404A  [SOT23-3']  169.52,82.31 90 top
Q24  MMBT5088  [SOT23-3]  164.6,47.7 90 top
Q25  MMBT5088  [SOT23-3]  158.88,47.54 90 top
Q26  FC-12M  [FC-12M]  175.87,77.07 90 top
Q27  P-CHANNEL-MOSFET  [SOT23-3']  189.29,23.42 270 top
Q28  MOSFET-NCHANNELAO3404A  [SOT23-3]  191.43,20.79 180 top
Q29  MOSFET-NCHANNELAO3404A  [SOT23-3]  190.48,16.98 180 top
Q30  MOSFET-NCHANNELFDD8780  [DPAK]  177.62,44.05 180 top
Q31  MOSFET-NCHANNELAO3404A  [SOT23-3]  171.53,164.41 0 bottom
Q32  MOSFET-NCHANNELAO3404A  [SOT23-3]  171.23,131.51 0 bottom
Q33  MOSFET-NCHANNELAO3404A  [SOT23-3]  150.03,25.7 270 bottom
Q34  MOSFET-NCHANNELAO3404A  [SOT23-3]  179.74,25.7 270 bottom
Q36  MOSFET-NCHANNELAO3404A  [SOT23-3]  85.99,139.7 90 top
Q38  MOSFET-NCHANNELAO3404A  [SOT23-3]  85.99,153.7 90 top
Q40  MOSFET-NCHANNELAO3404A  [SOT23-3]  85.99,167.7 90 top
Q42  MOSFET-NCHANNELAO3404A  [SOT23-3]  85.99,181.7 90 top
Q44  MOSFET-NCHANNELAO3404A  [SOT23-3]  85.99,195.7 90 top
Q46  MOSFET-NCHANNELAO3404A  [SOT23-3]  85.99,209.7 90 top
Q48  MOSFET-NCHANNELAO3404A  [SOT23-3]  85.99,223.7 90 top
R1  250  [0402-RES]  122.21,11.03 180 bottom
R2  250  [0402-RES]  117.13,10.87 180 bottom
R3  250  [0402-RES]  112.21,11.03 180 bottom
R4  250  [0402-RES]  107.13,10.87 180 bottom
R5  100k  [0402-RES]  169.84,48.02 180 top
R6  100k  [0402-RES]  161.9,49.13 180 top
R7  2k2  [0402-RES]  125.19,237.77 0 top
R8  2k2  [0402-RES]  125.19,226.97 180 top
R9  330  [0402-RES]  176.31,221.73 90 top
R10  330  [0402-RES]  176.31,216.65 90 top
R13  [0402-RES']  133.12,230.65 0 bottom
R14  [0402-RES']  130.71,230.65 0 bottom
R15  [0402-RES']  126.71,224.93 0 bottom
R16  [0402-RES']  126.84,226.84 0 bottom
R17  2k2  [0402-RES]  135.22,188.42 180 bottom
R18  2k2  [0402-RES]  135.22,189.77 0 bottom
R29  10k  [0402-RES]  83.45,17.35 270 top
R30  0.001  [2512]  57.73,23.39 180 top
R31  0  [0402-RES]  60.91,15.45 0 bottom
R32  125  [1206]  74.4,13.7 180 bottom
R33  250  [0402-RES]  99.33,20.05 180 top
R34  100k  [0402-RES]  88.05,13.7 270 top
R35  10k  [0402-RES]  83.45,13.7 270 top
R36  250  [0402-RES]  82.97,18.94 180 top
R37  [0603-RES]  172.82,218.24 90 top
R38  47  [0402-RES]  79.48,17.99 180 bottom
R39  47  [0402-RES]  101.87,17.35 180 bottom
R40  10k  [0402-RES]  85.43,20.53 180 top
R41  [1206]  96.63,13.07 180 bottom
R42  125  [0402-RES]  14.87,18.78 180 bottom
R43  125  [0402-RES]  14.87,16.72 180 bottom
R44  10k  [0402-RES]  95.52,19.1 0 top
R45  0  [0805]  59.32,16.88 0 bottom
R46  10k  [0402-RES]  88.69,23.07 0 top
R47  100k  [0402-RES]  99.33,21.32 0 top
R48  250  [0402-RES]  67.89,21.96 0 top
R49  250  [0402-RES]  67.89,23.86 0 top
R50  10k  [0402-RES]  83.45,31.35 270 top
R51  0.001  [2512]  57.73,37.39 180 top
R52  0  [0402-RES]  60.91,29.45 0 bottom
R53  125  [1206]  74.4,27.7 180 bottom
R54  250  [0402-RES]  99.33,34.05 180 top
R55  100k  [0402-RES]  88.05,27.7 270 top
R56  10k  [0402-RES]  83.45,27.7 270 top